# EasyEDA schematic Esquematico.json

## Sheets
1 ESP32-S3: TITLE: Sheet_1; REV: 1.0; Date: 2026-09-23; Sheet: 1/1; Company: Your Company
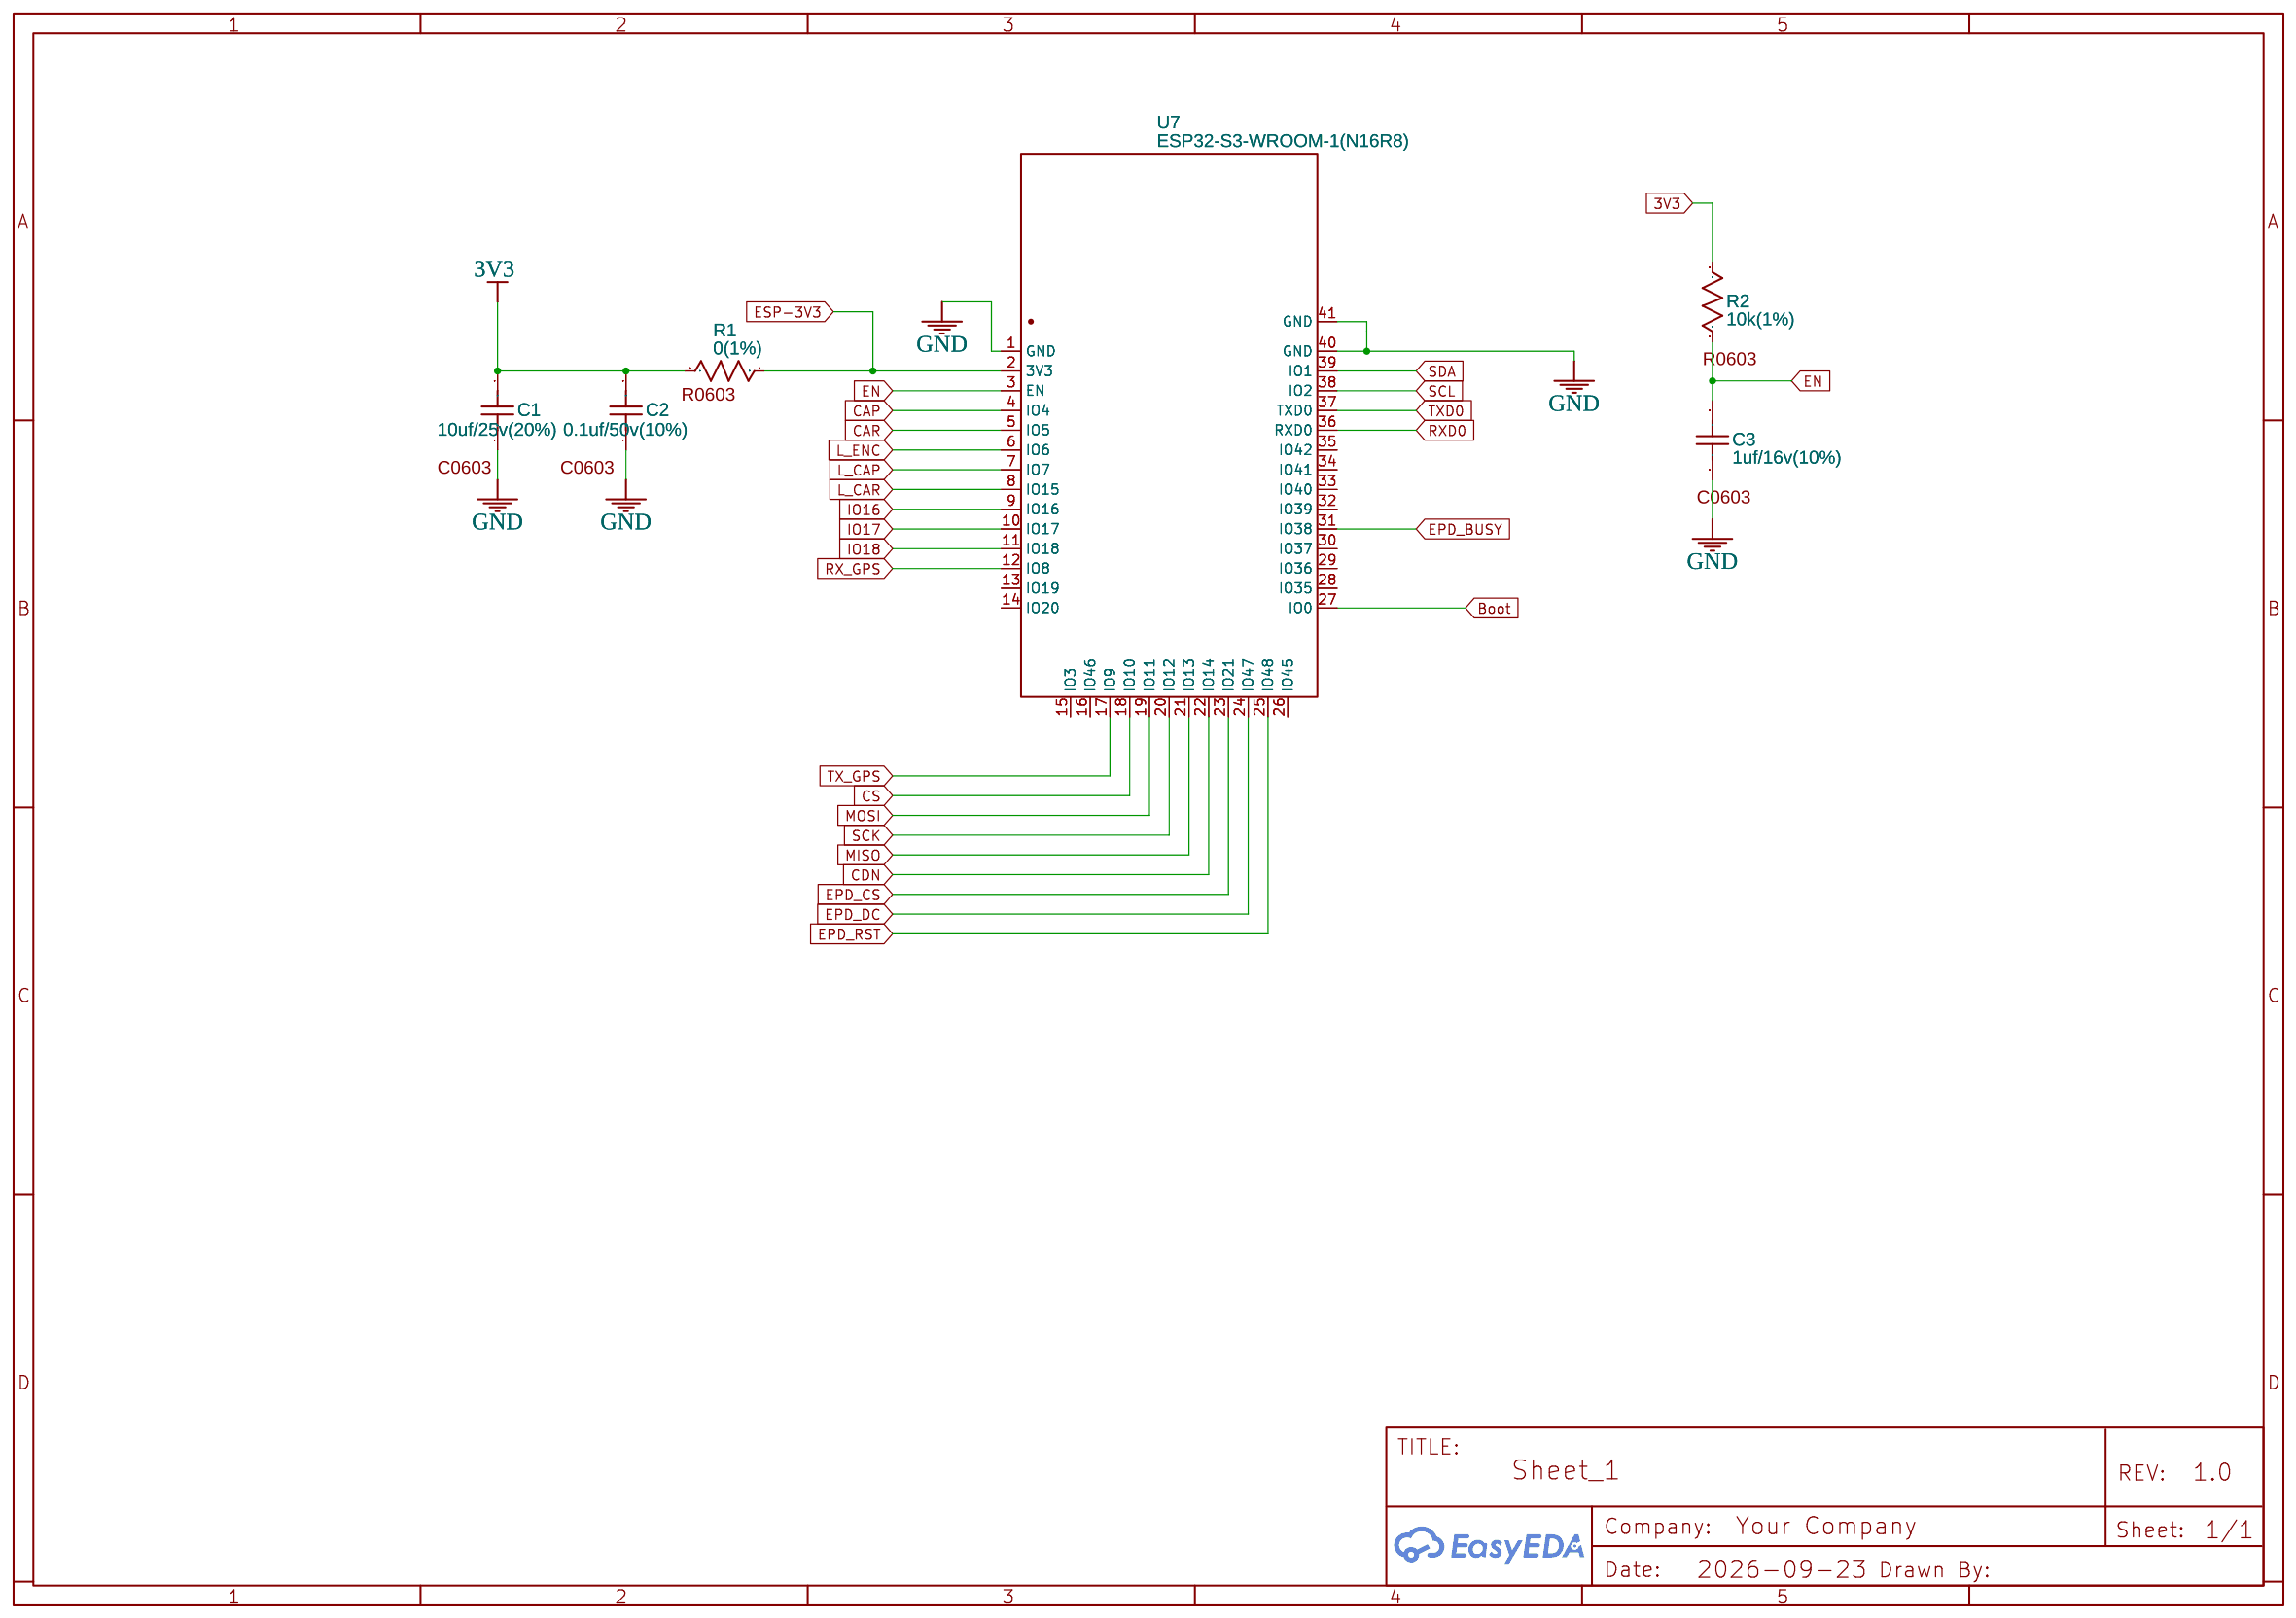
[diagram p0: ESP32-S3]
2 Programacion: TITLE: Sheet_2; Date: 2026-09-24
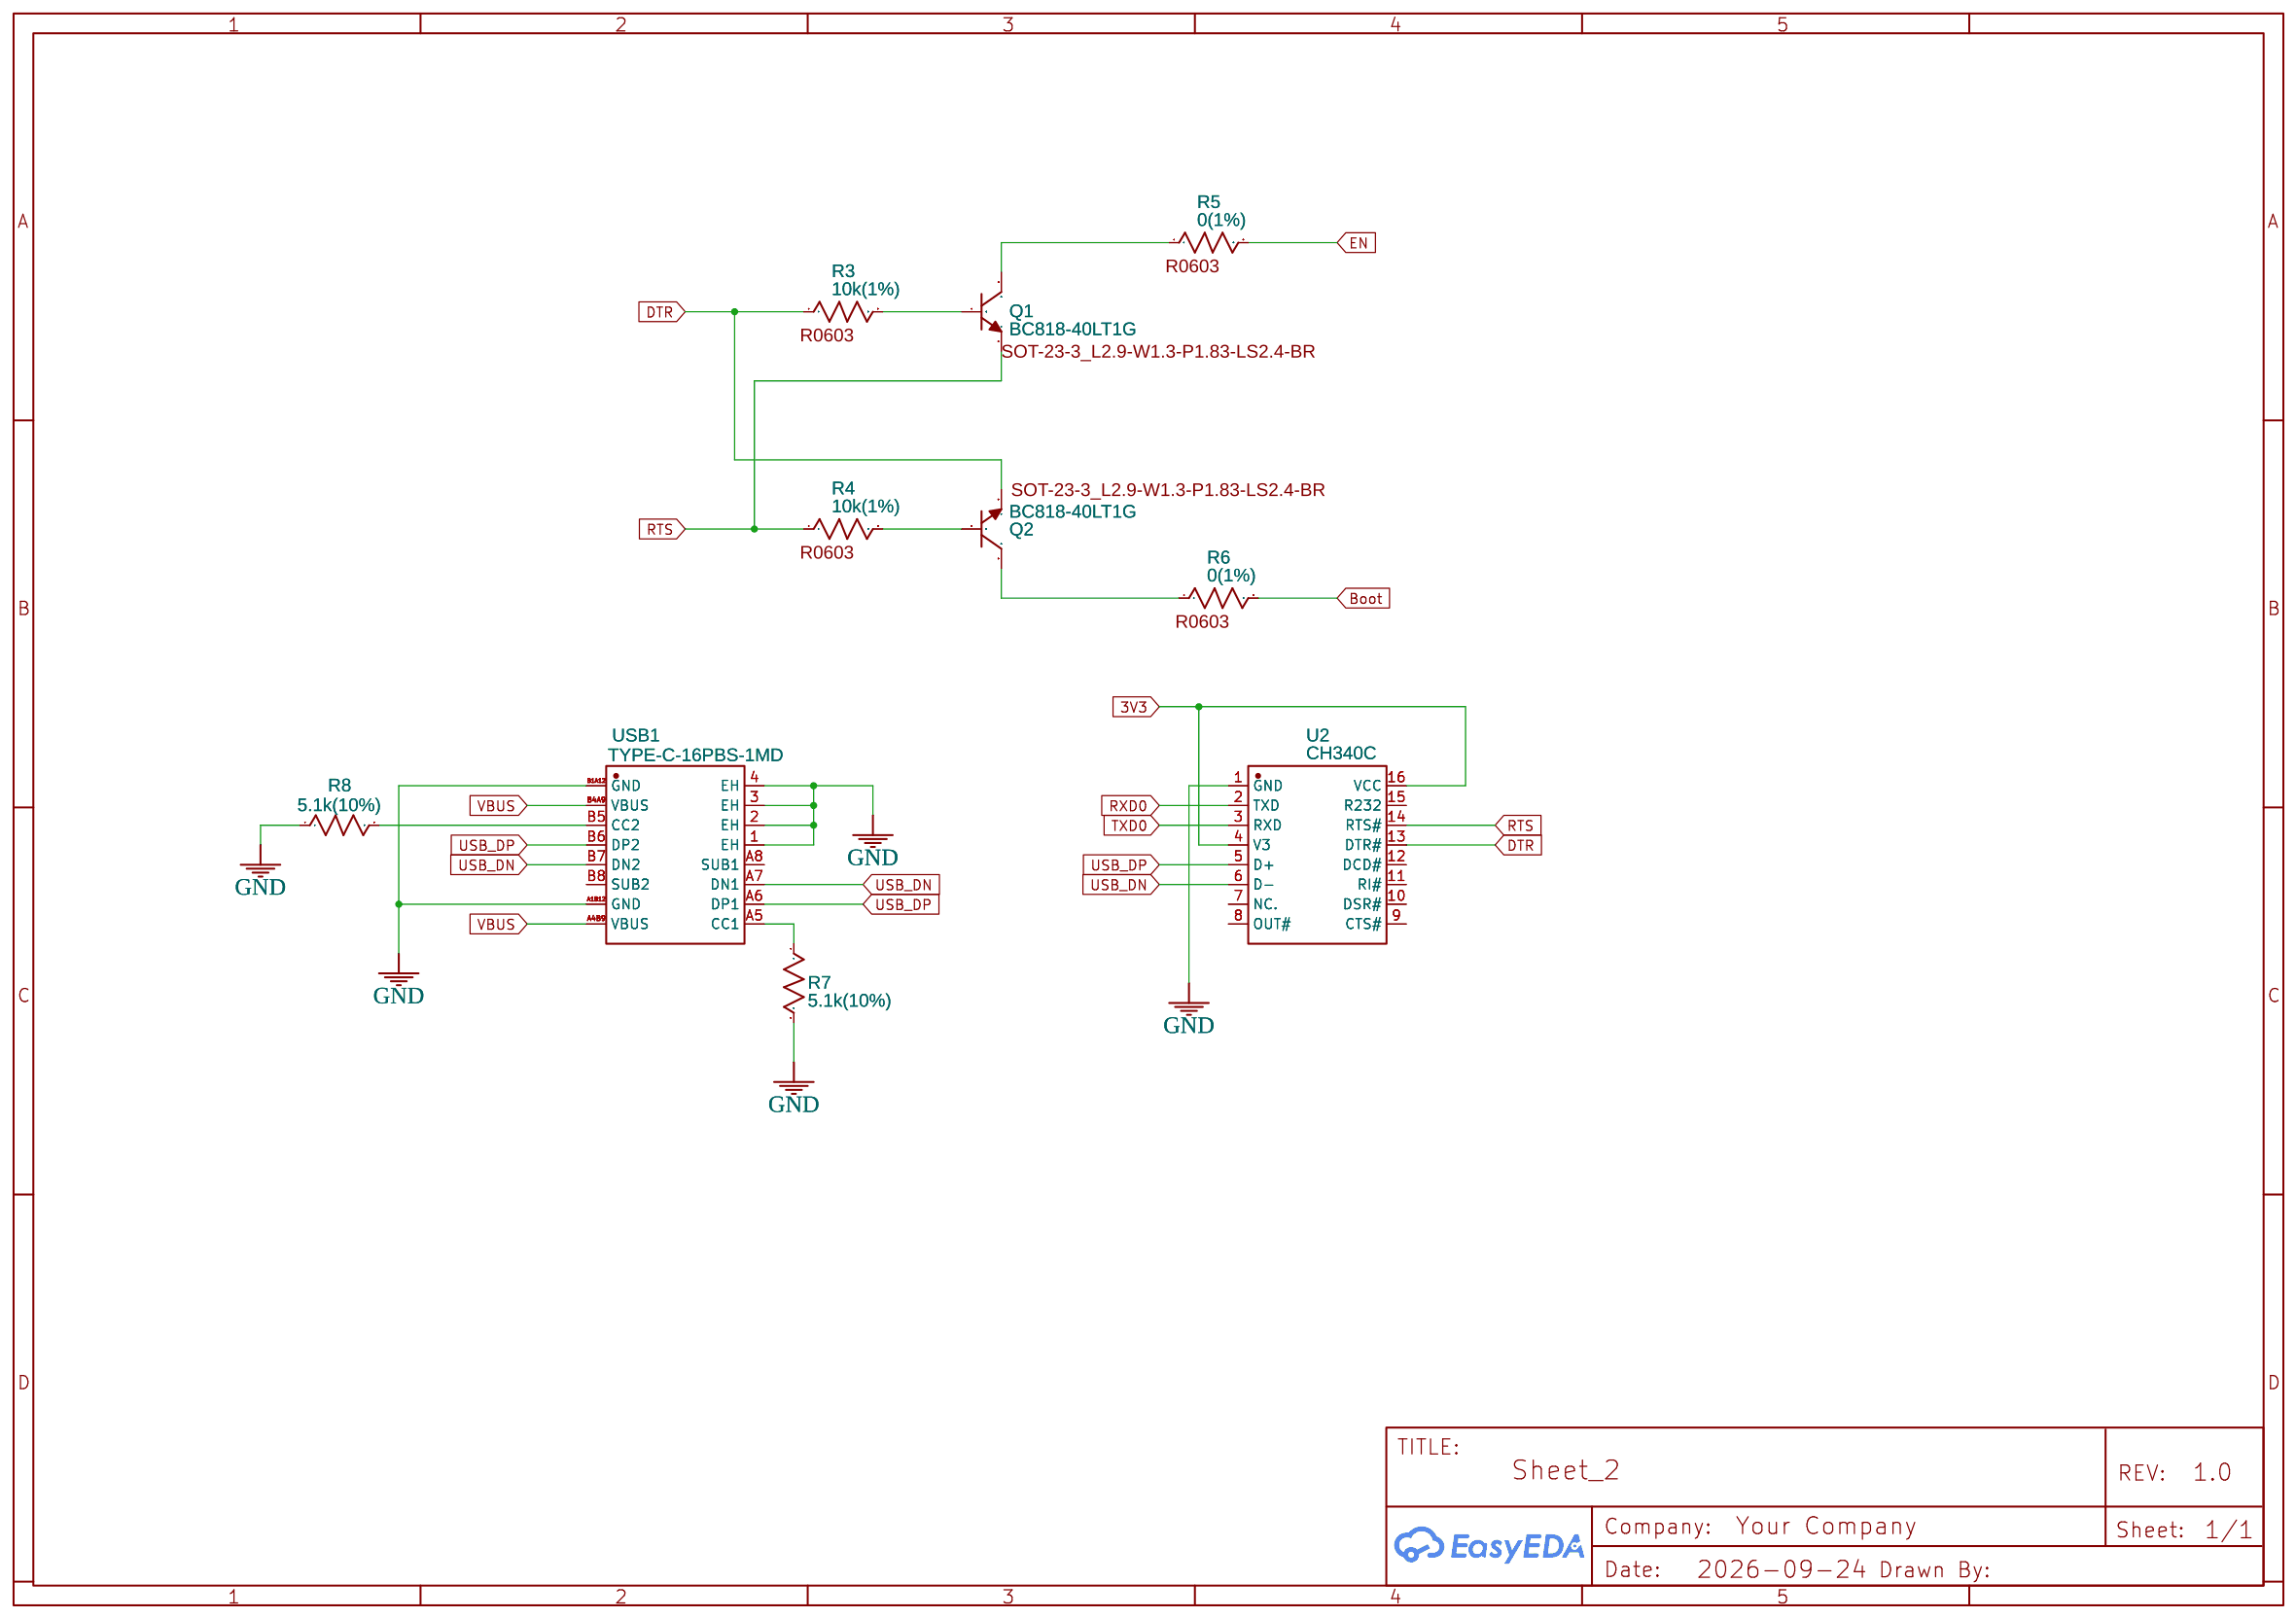
[diagram p1: Programacion]
3 12V a 3V3: TITLE: Sheet_2; Date: 2026-09-24
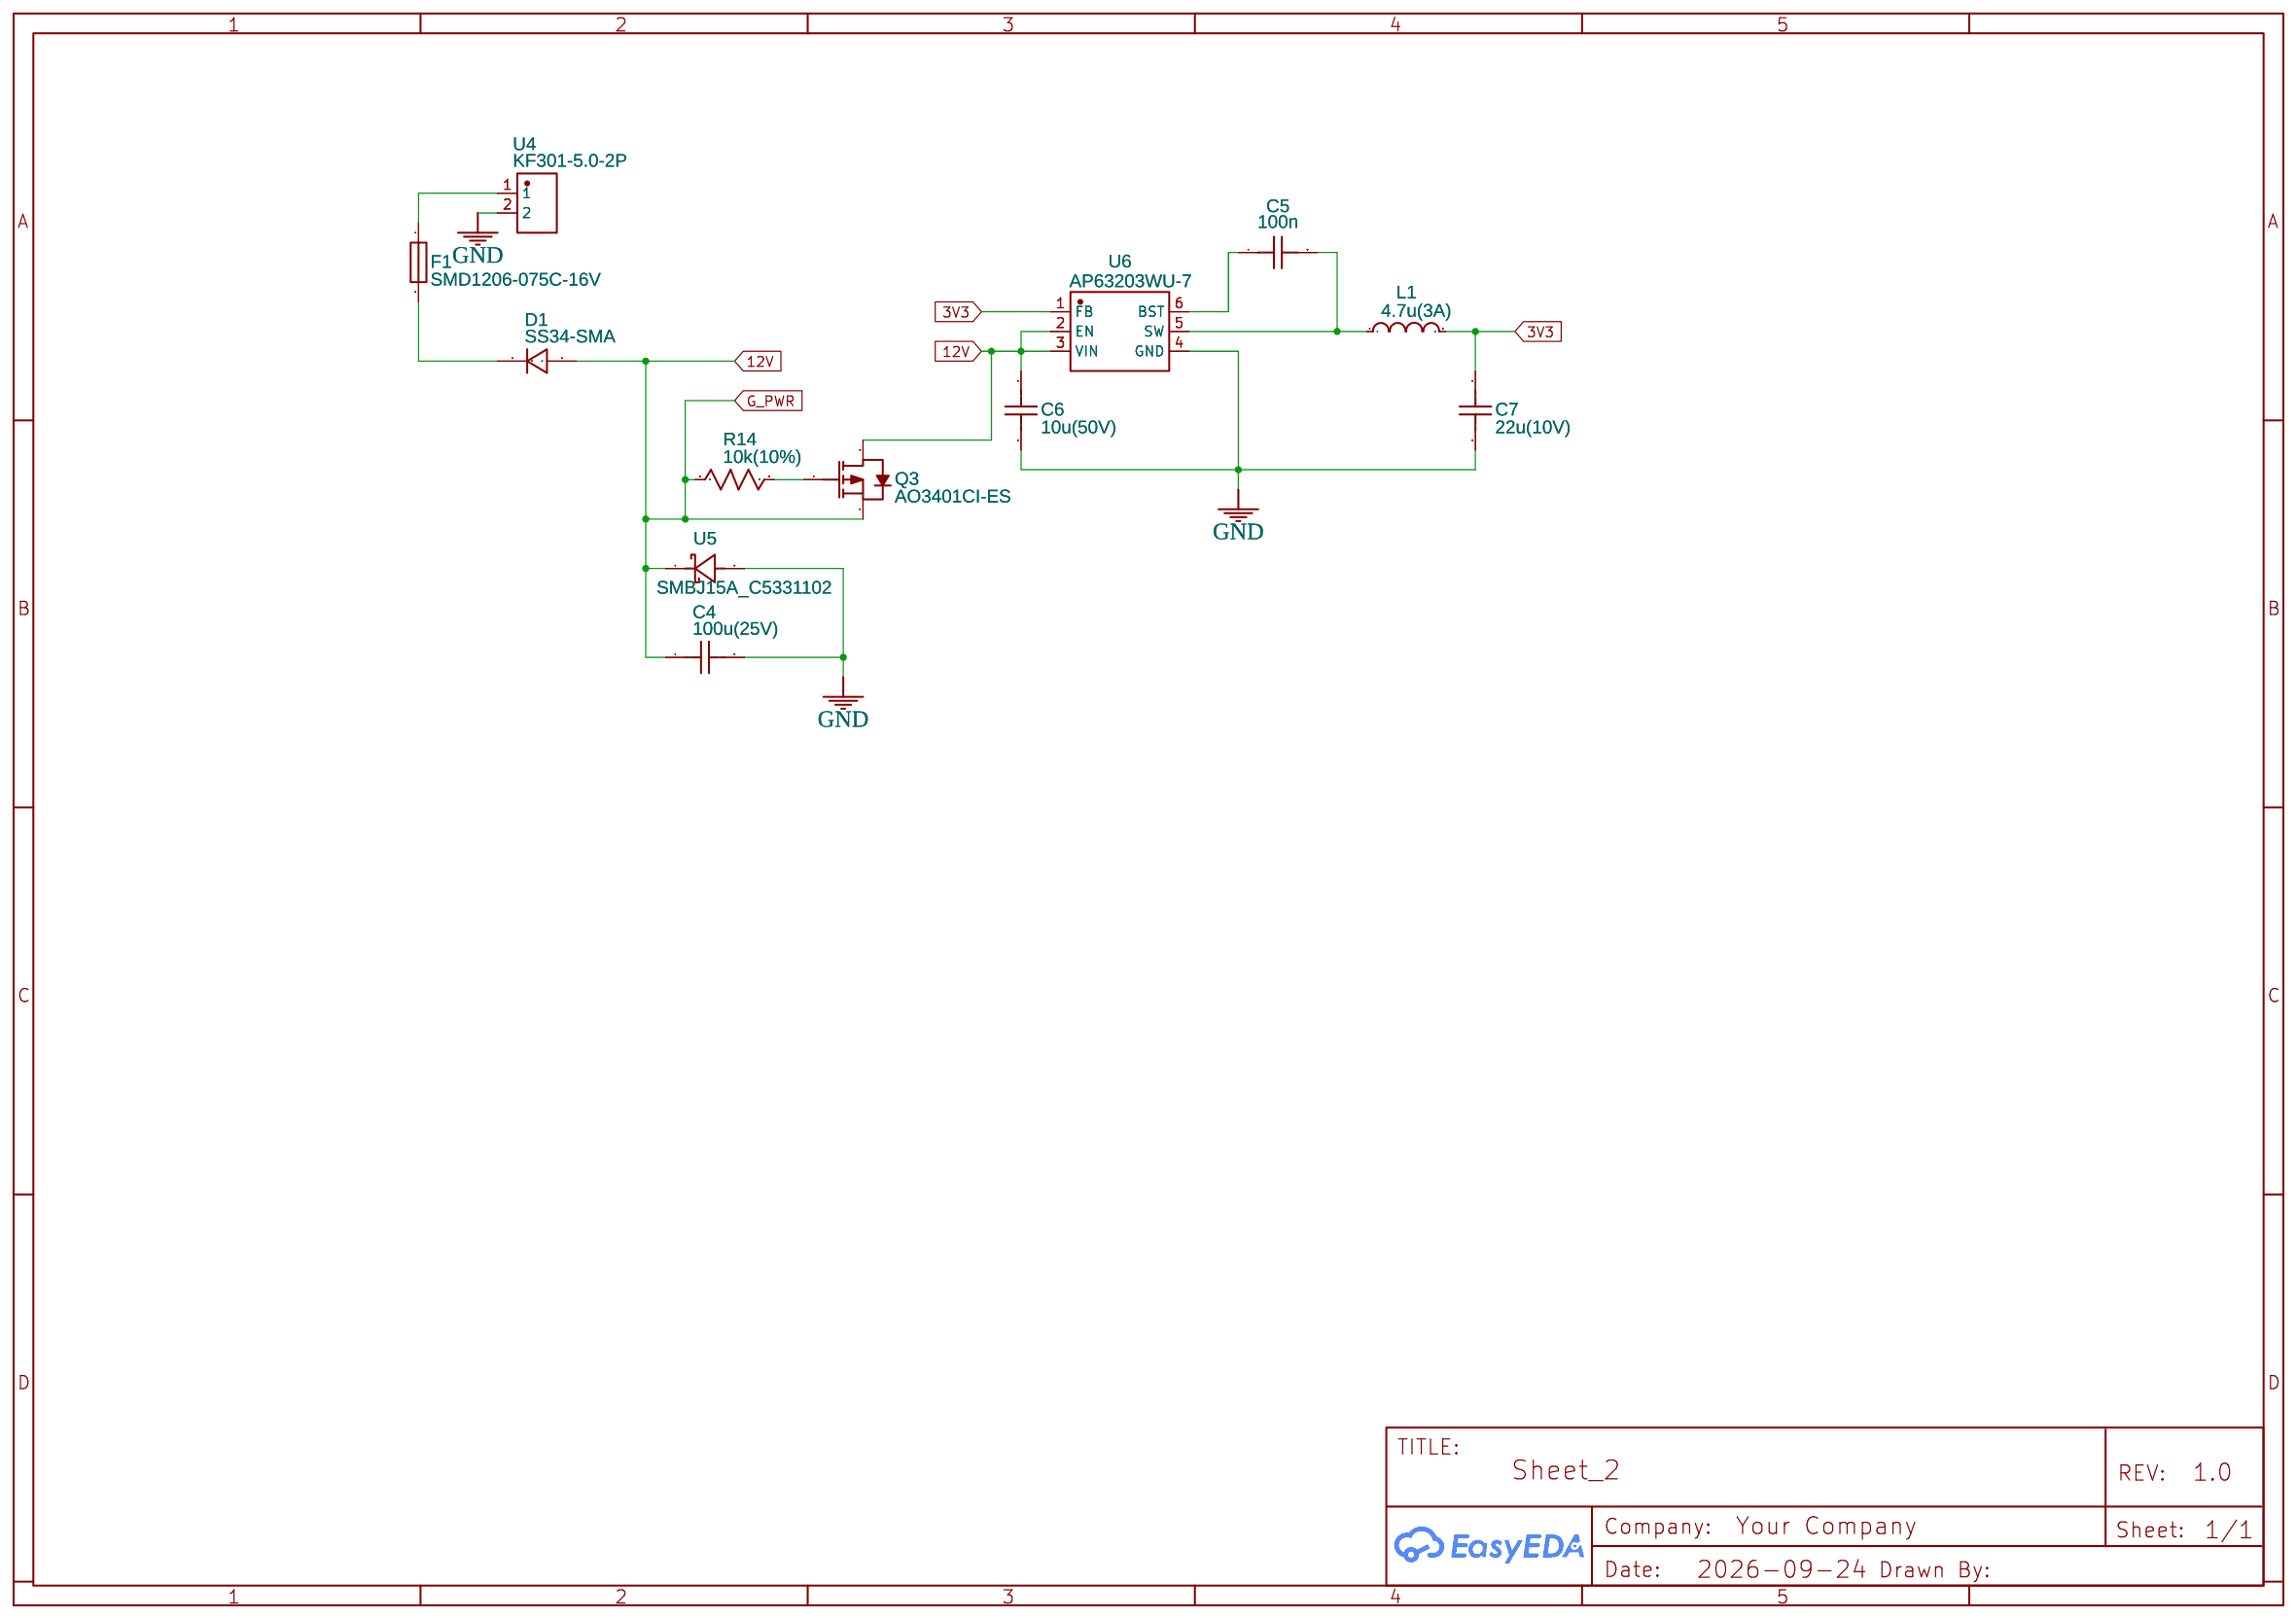
[diagram p2: 12V a 3V3]
4 sensor NPK, PH, HUMEDAD: TITLE: Sheet_2; Date: 2026-09-24
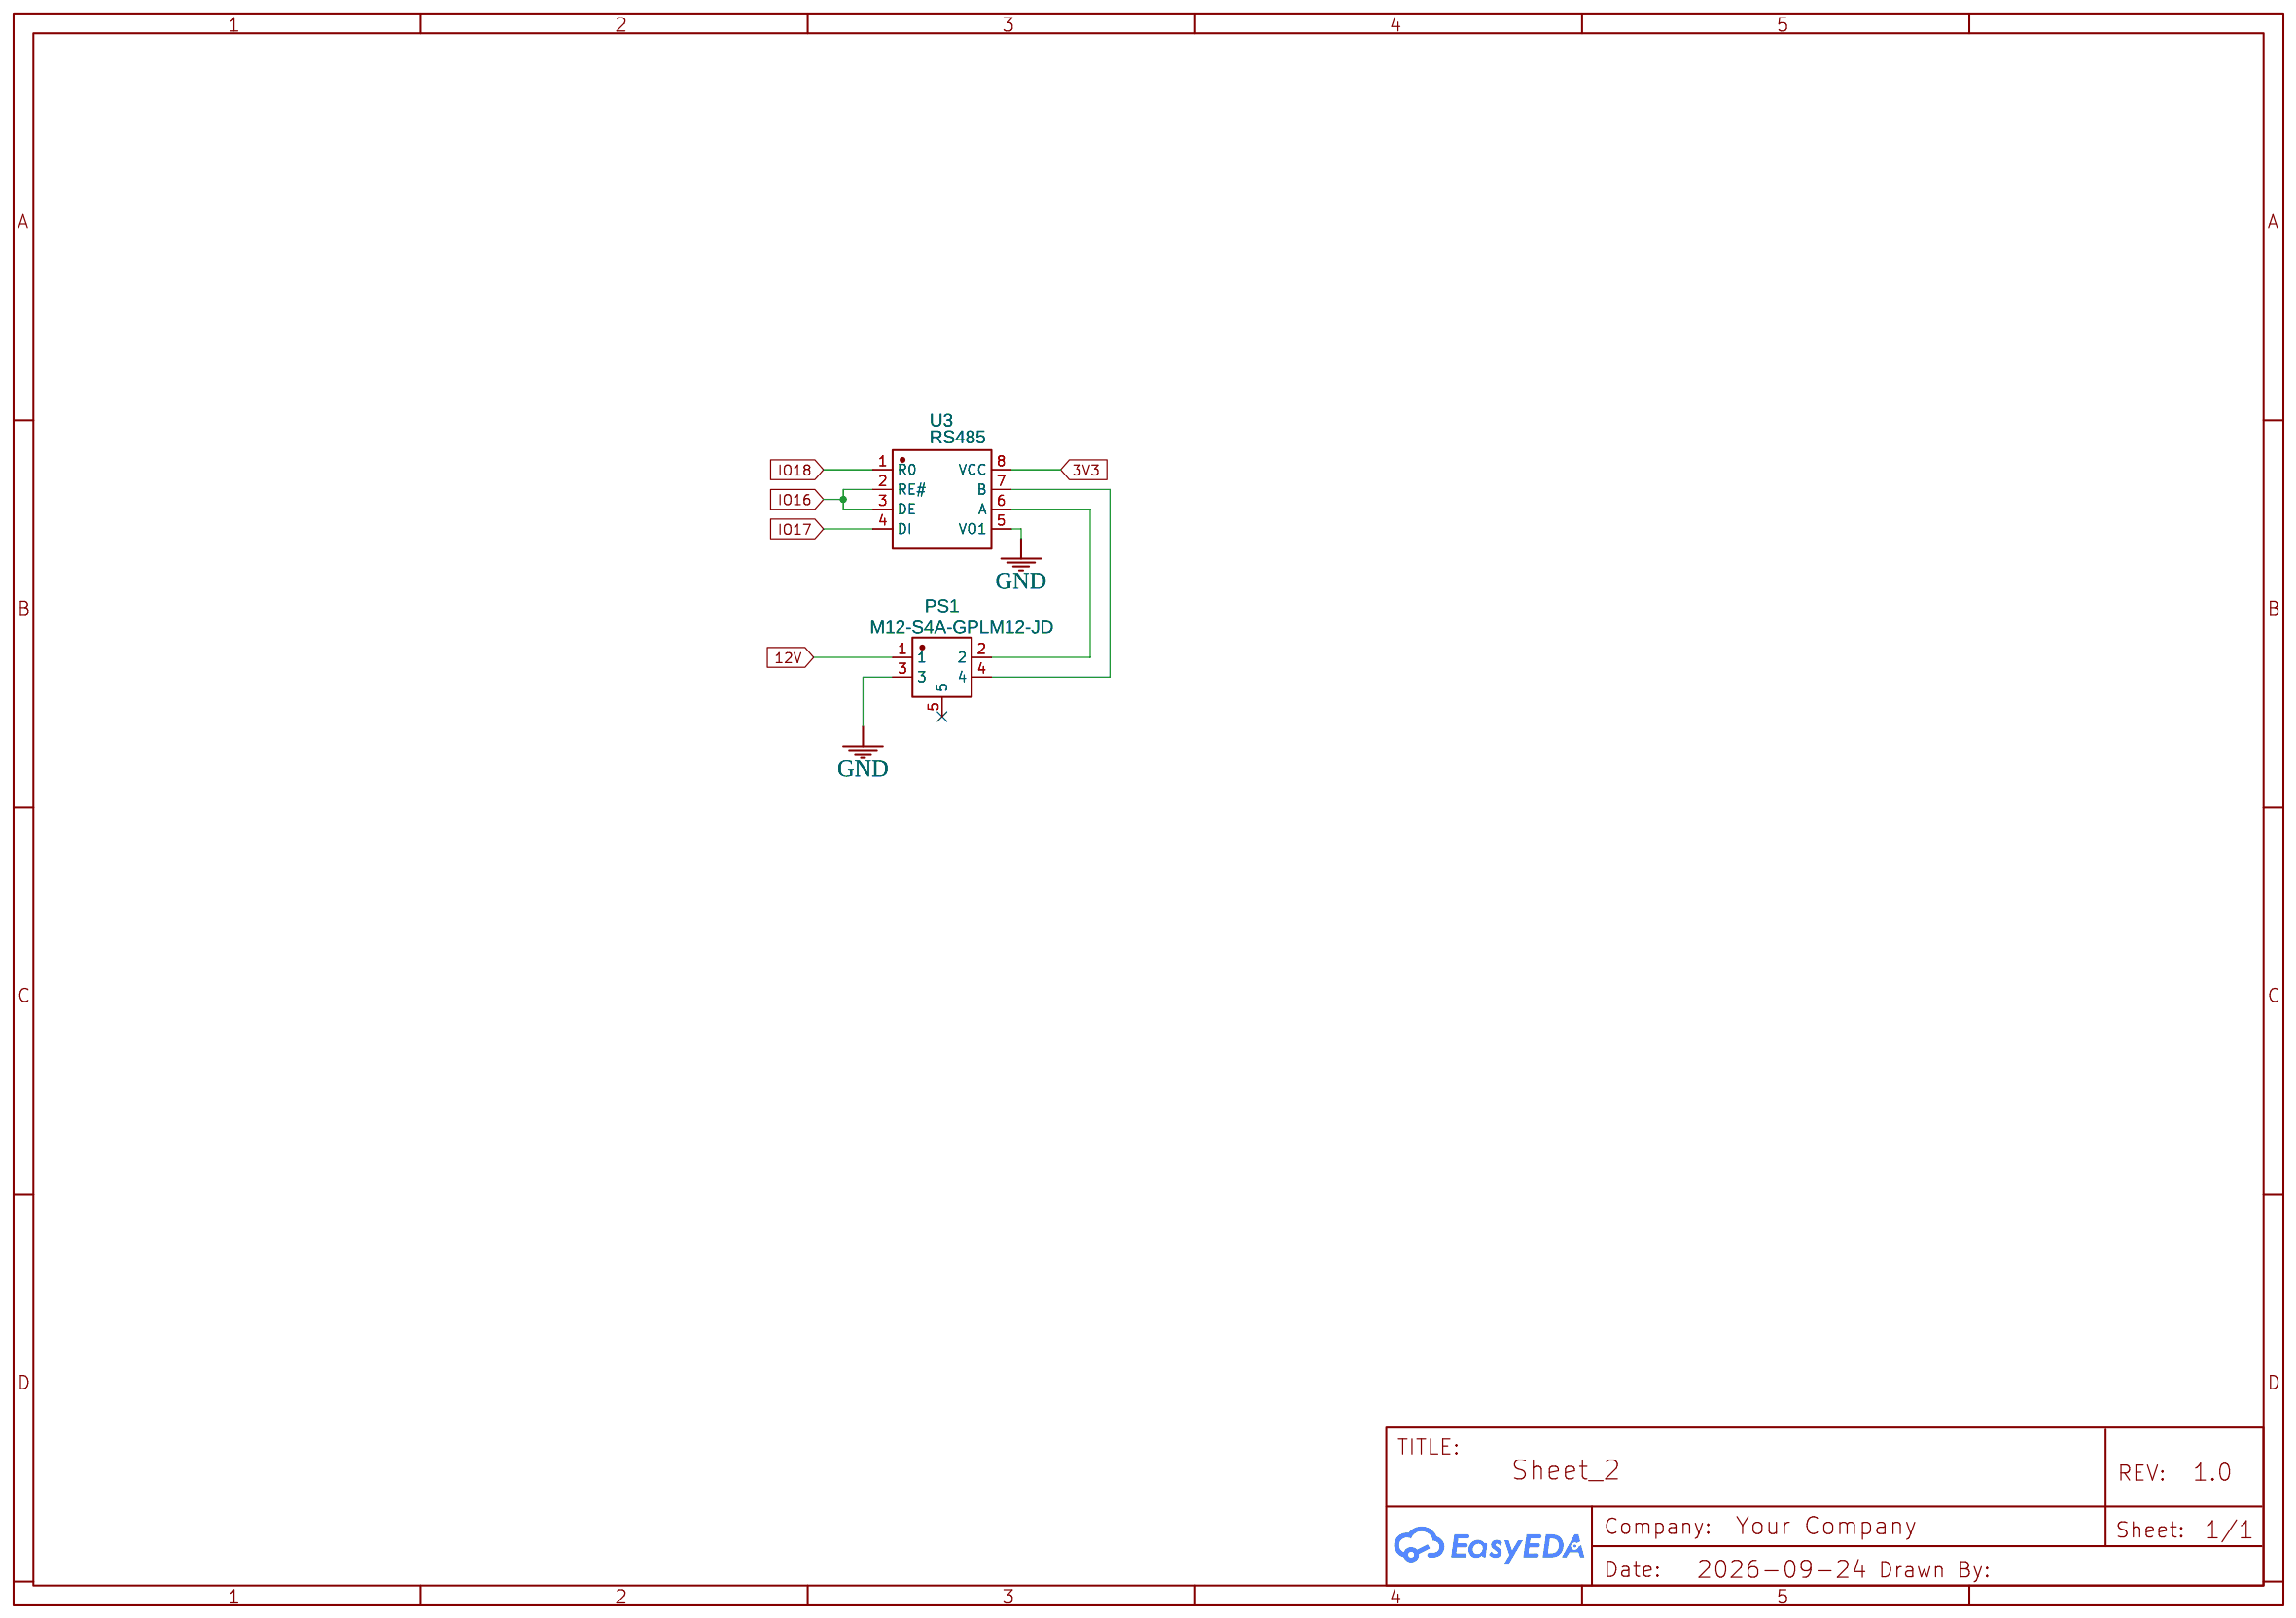
[diagram p3: sensor NPK, PH, HUMEDAD]
5 EPAPER: Date: 2026-09-24
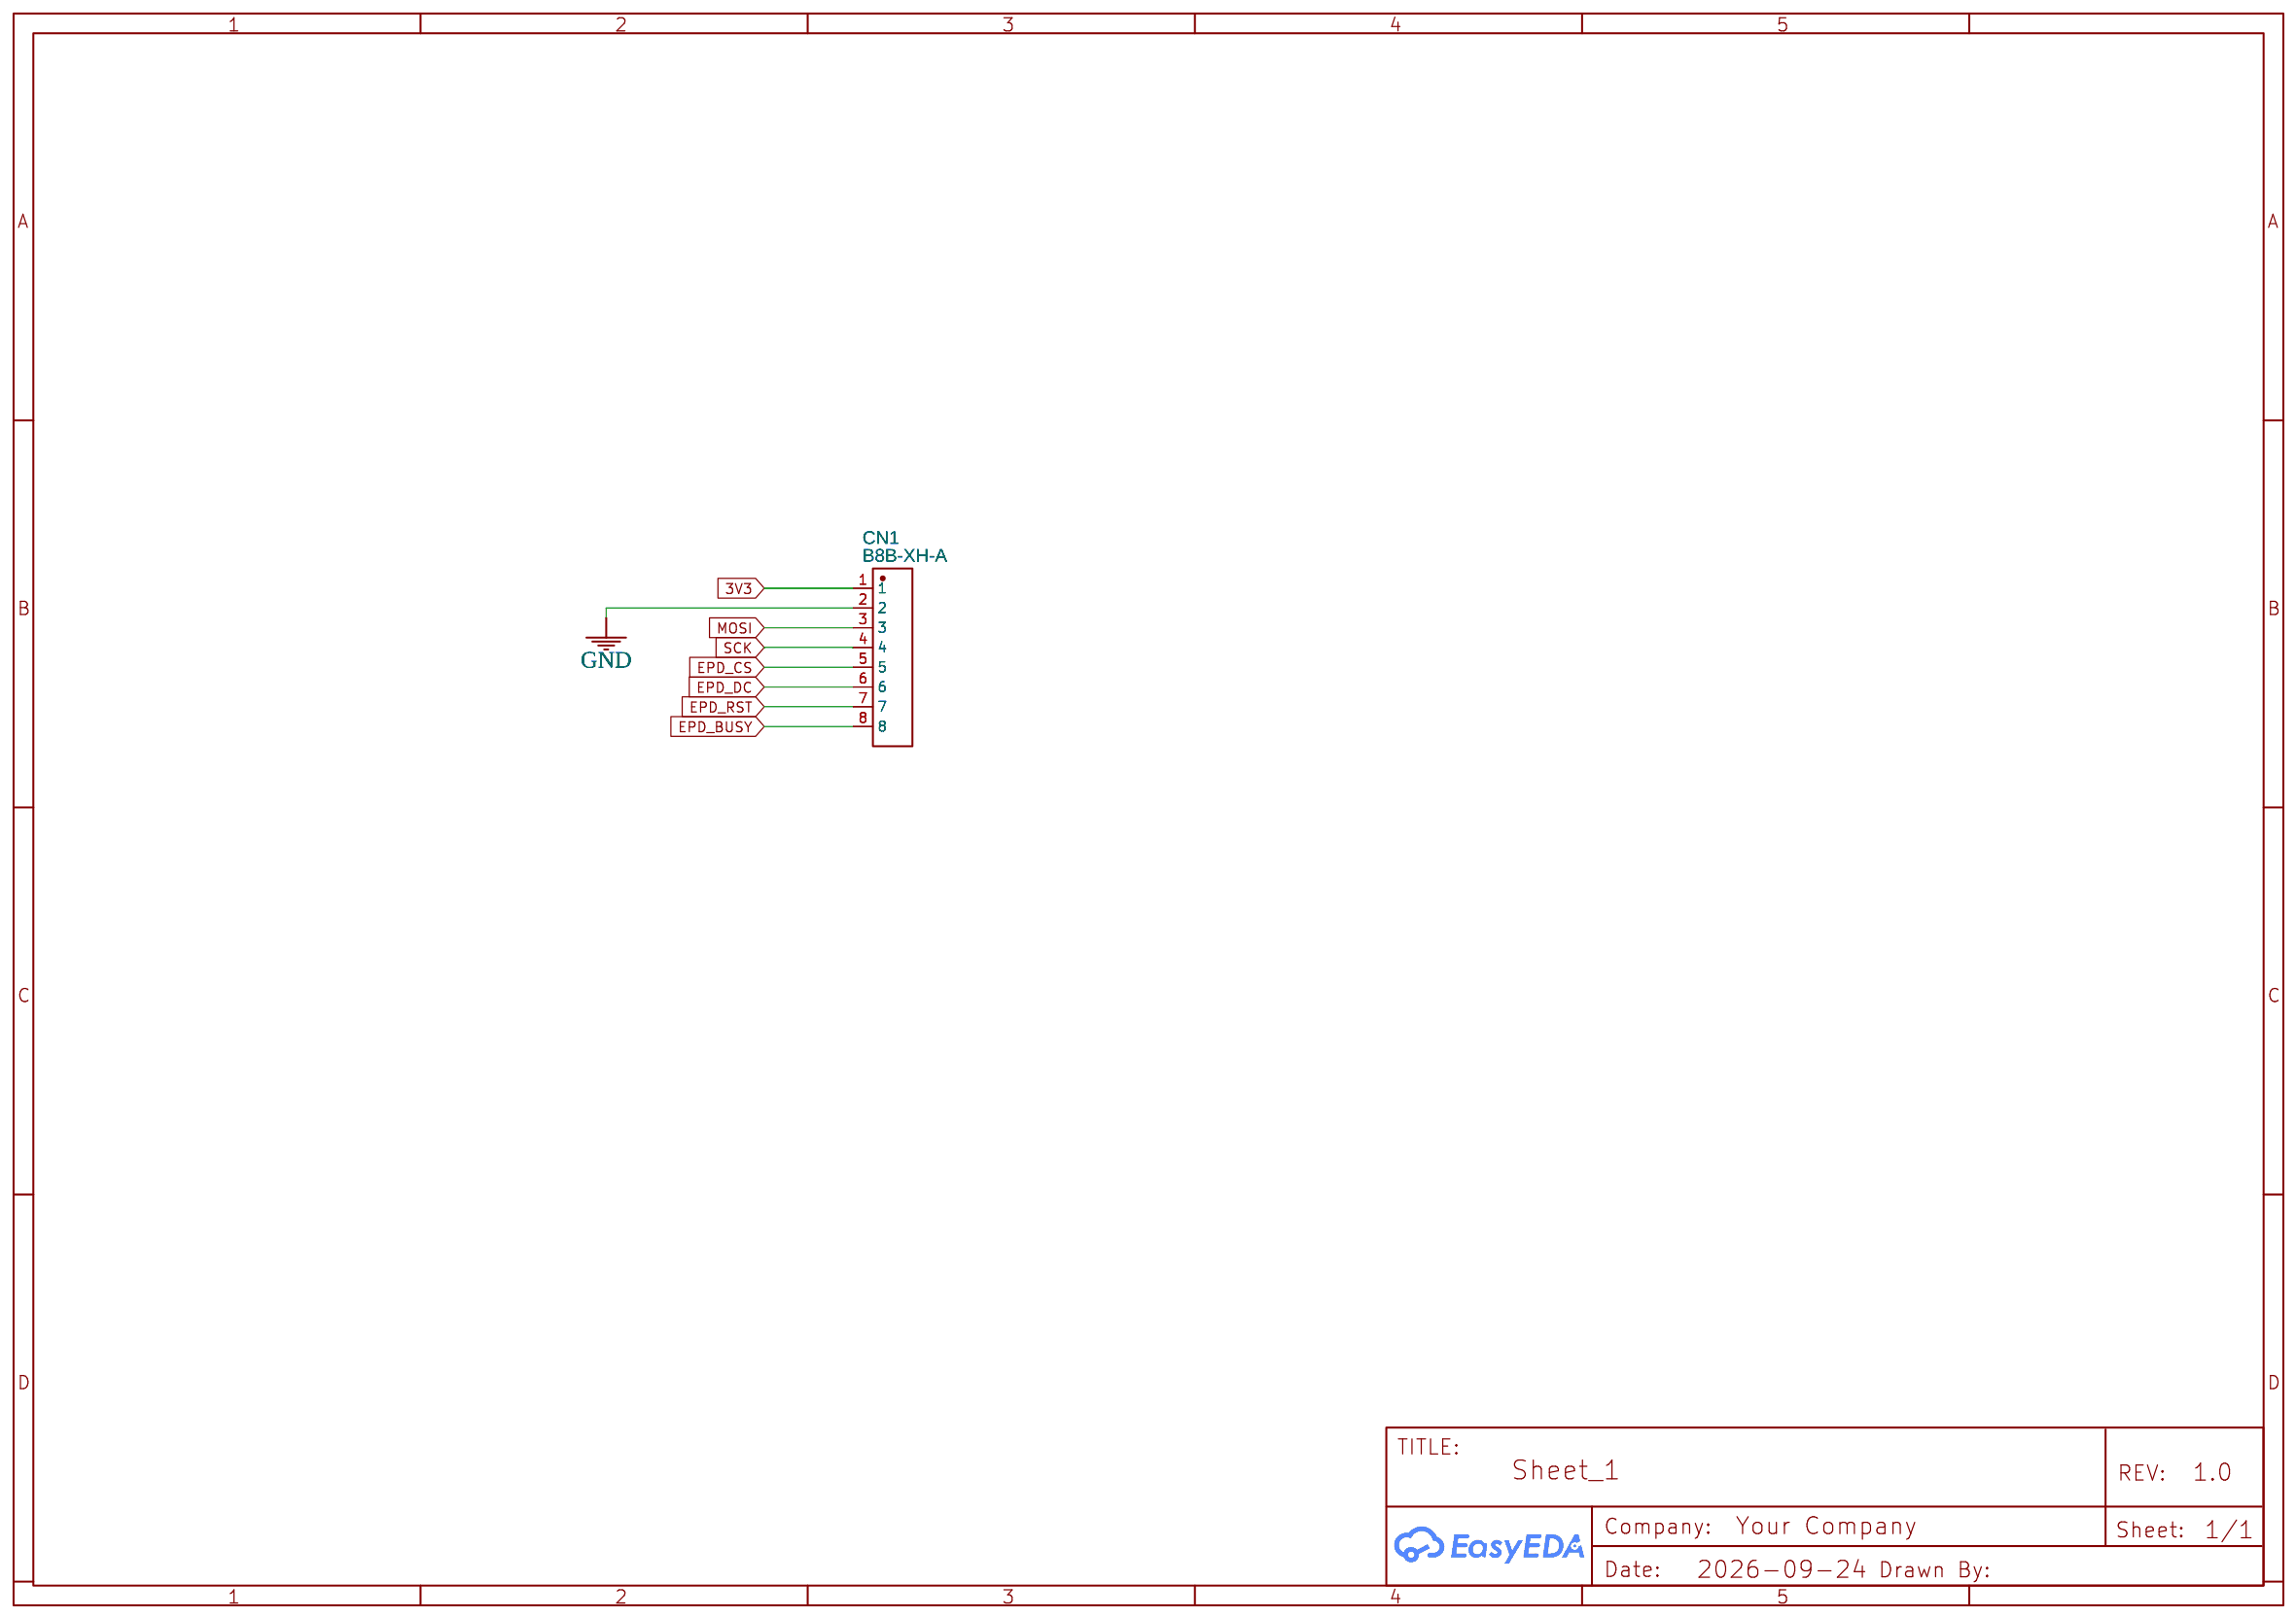
[diagram p4: EPAPER]
6 Reloj: Date: 2026-09-24
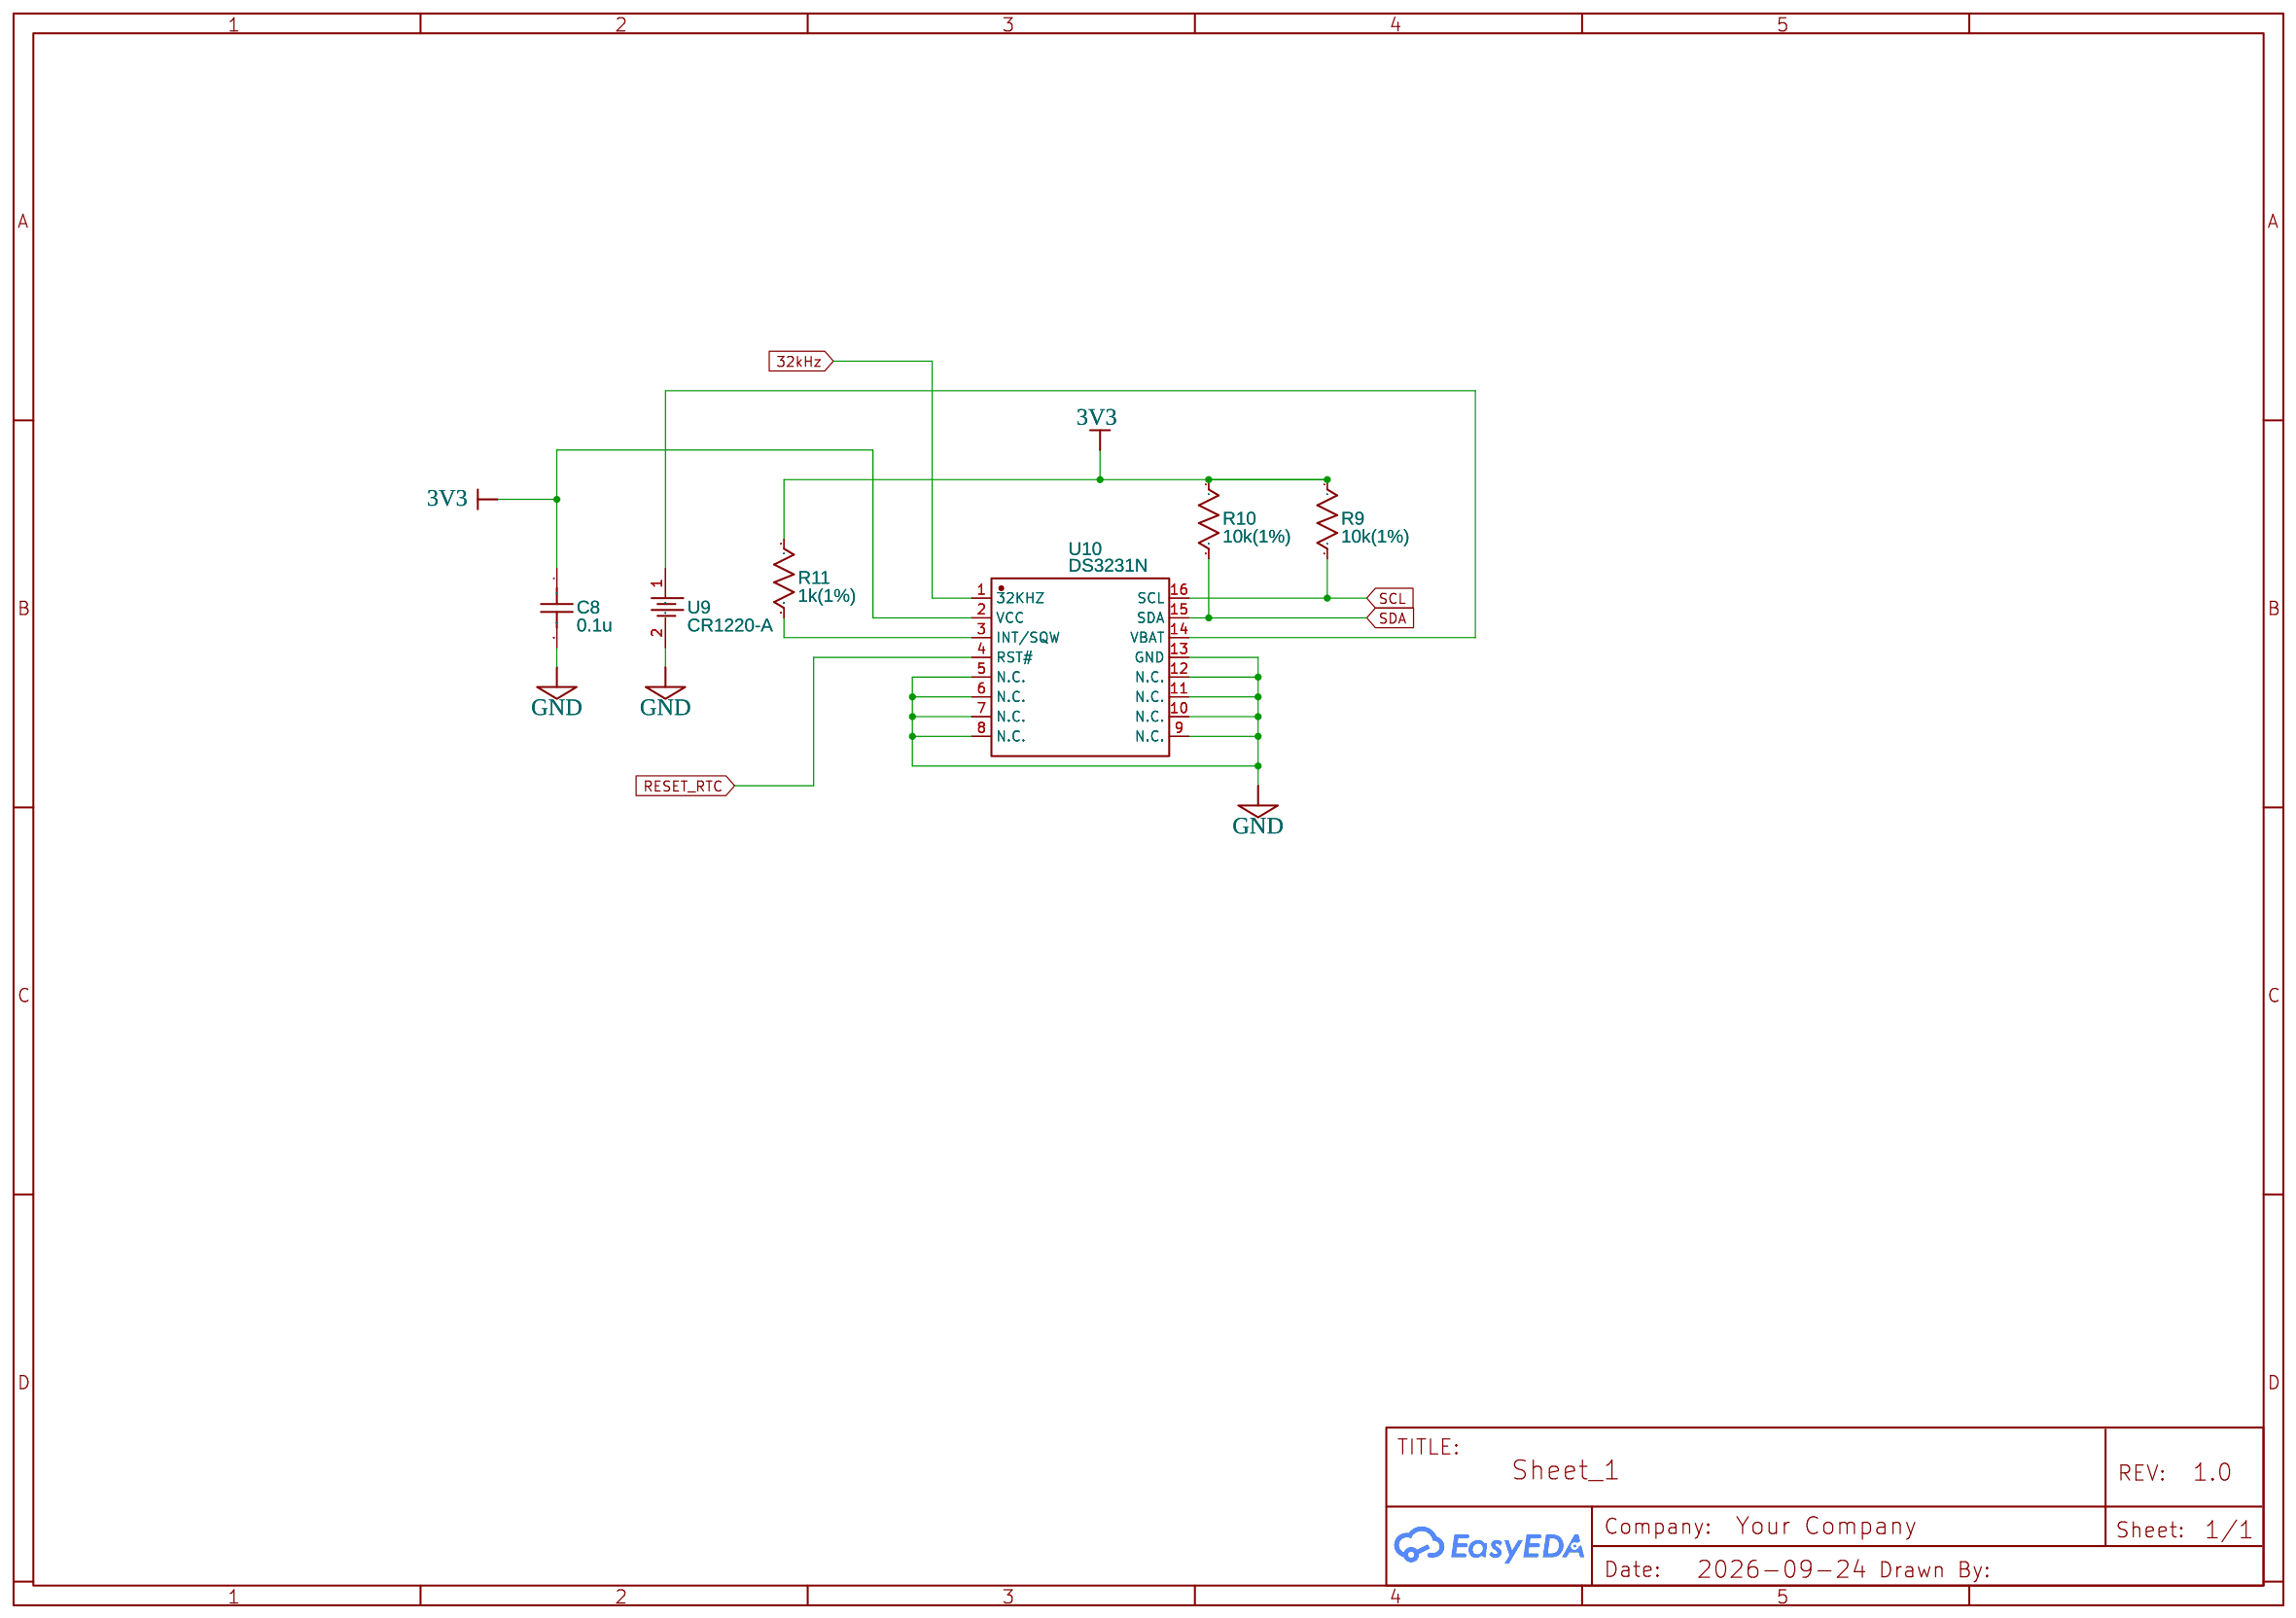
[diagram p5: Reloj]
7 Botones: Date: 2026-09-24
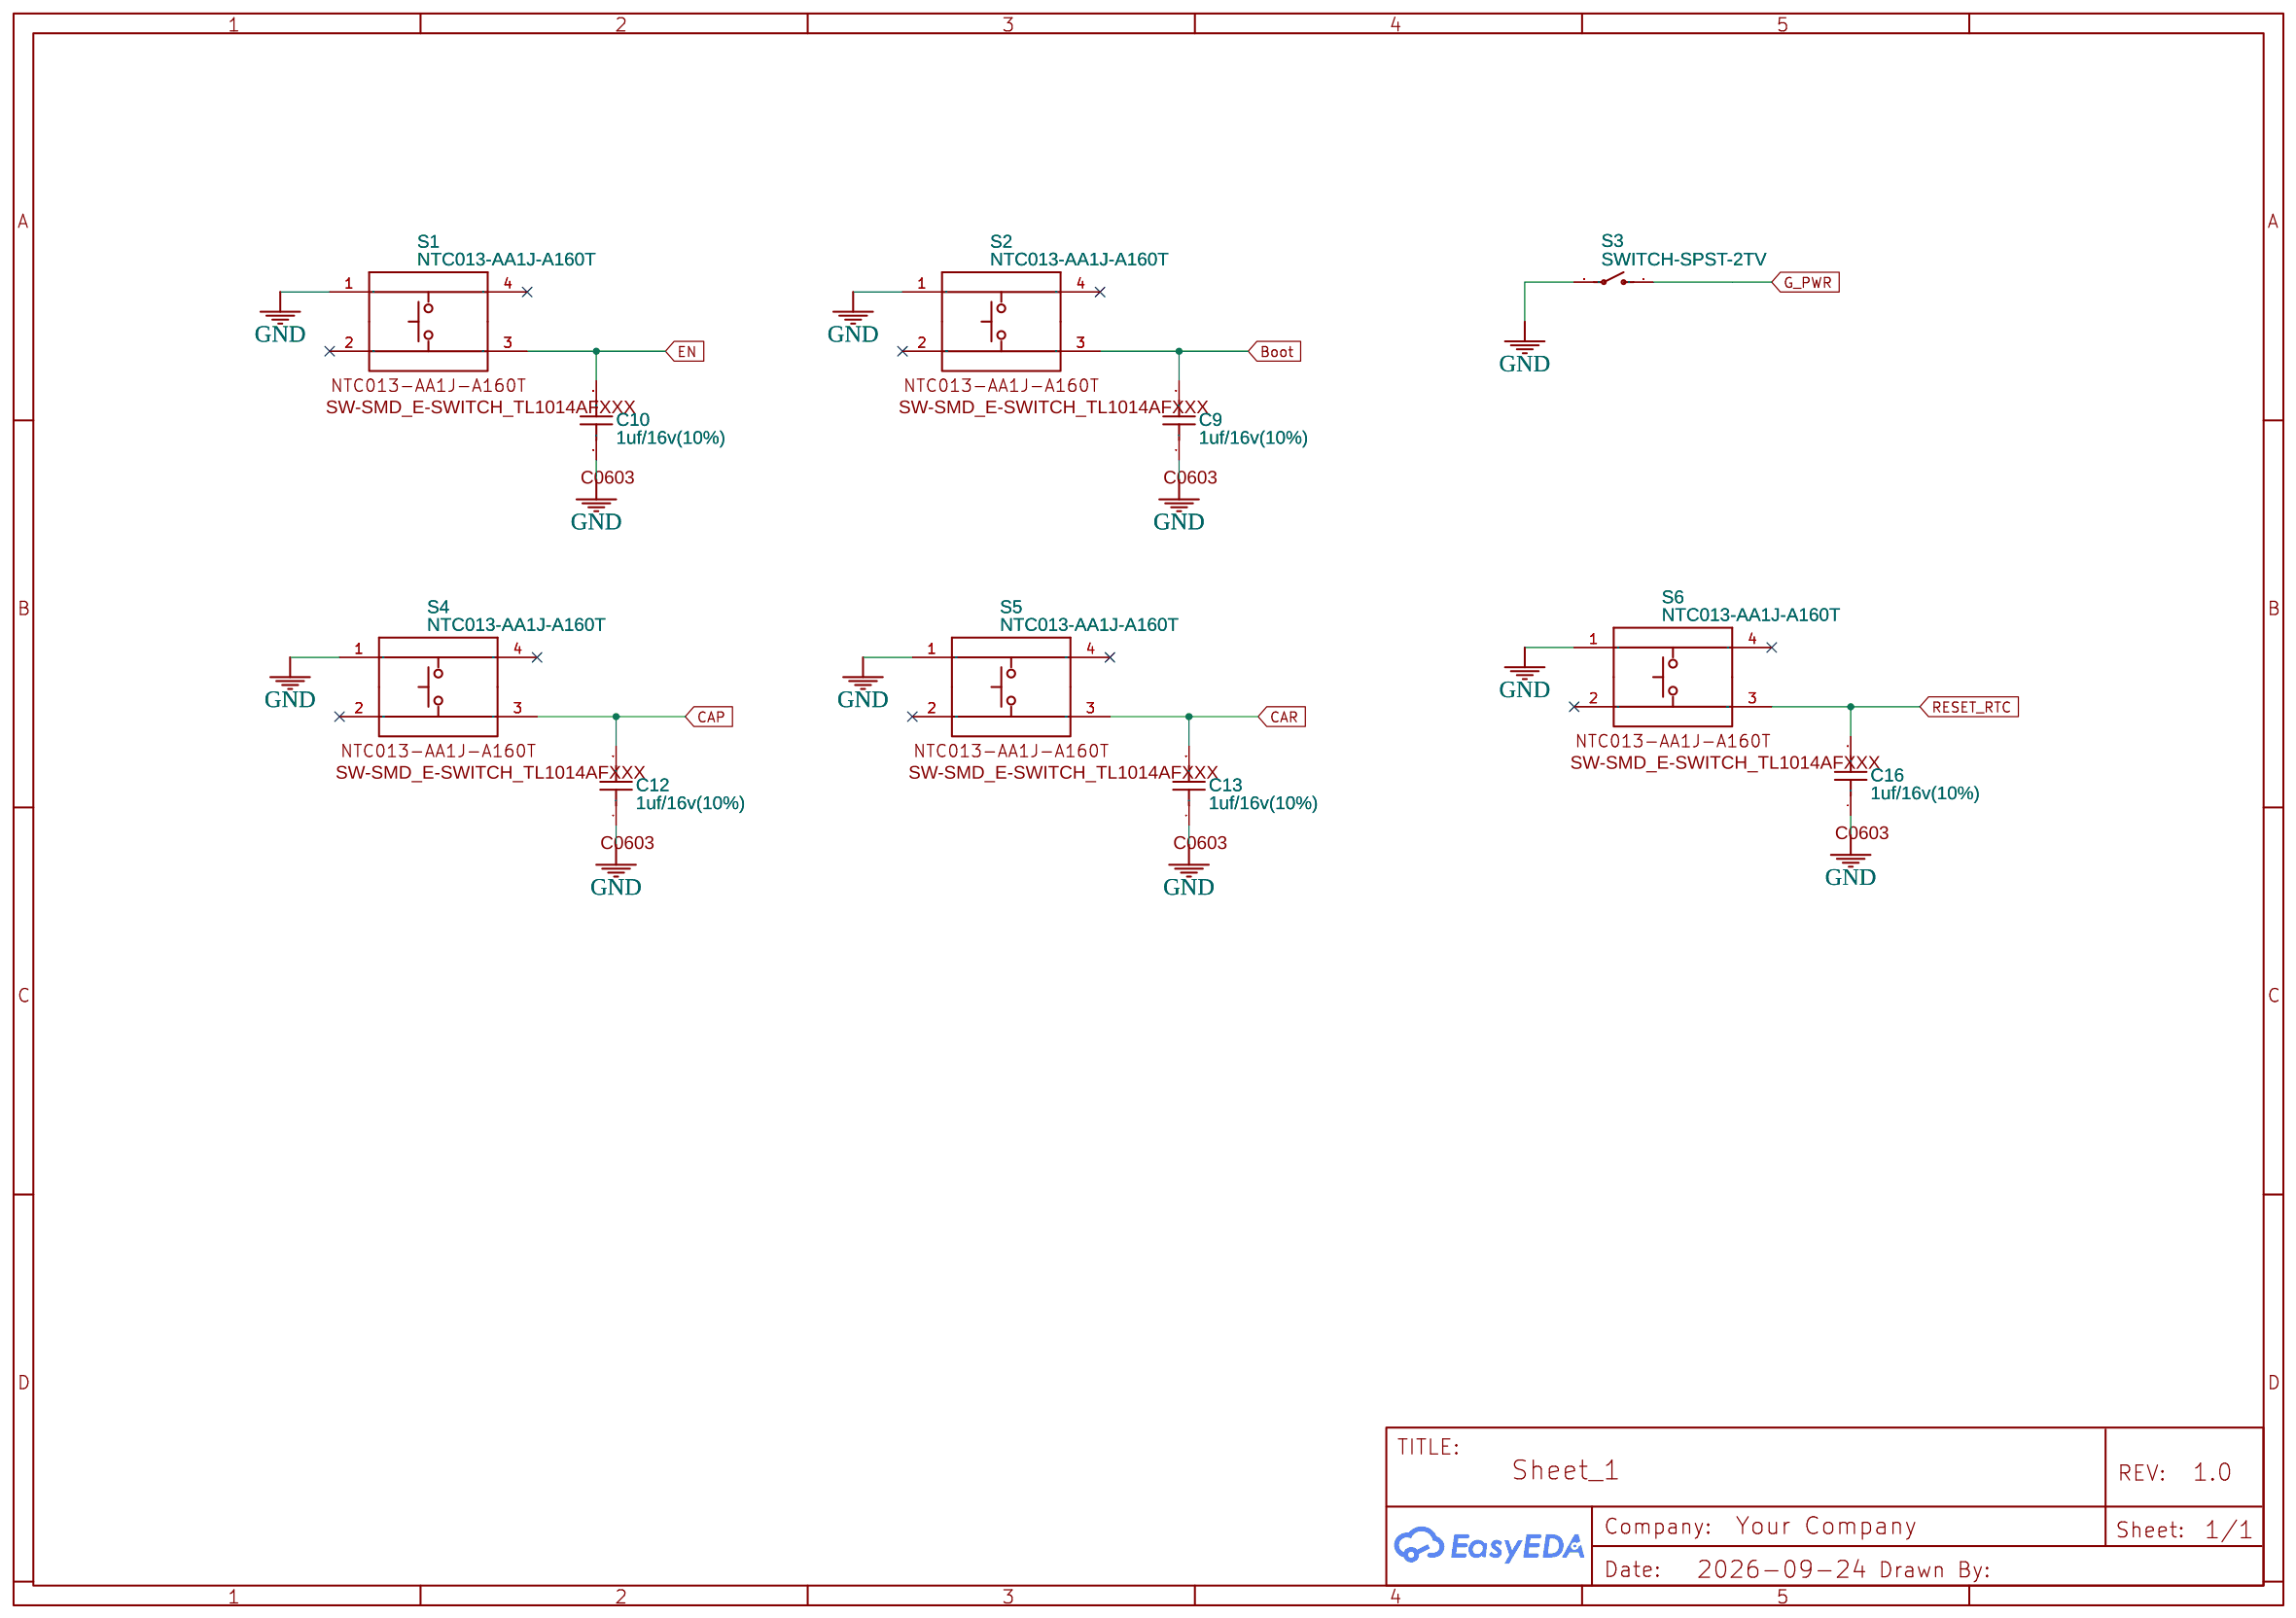
[diagram p6: Botones]
8 GPS: Date: 2026-09-24
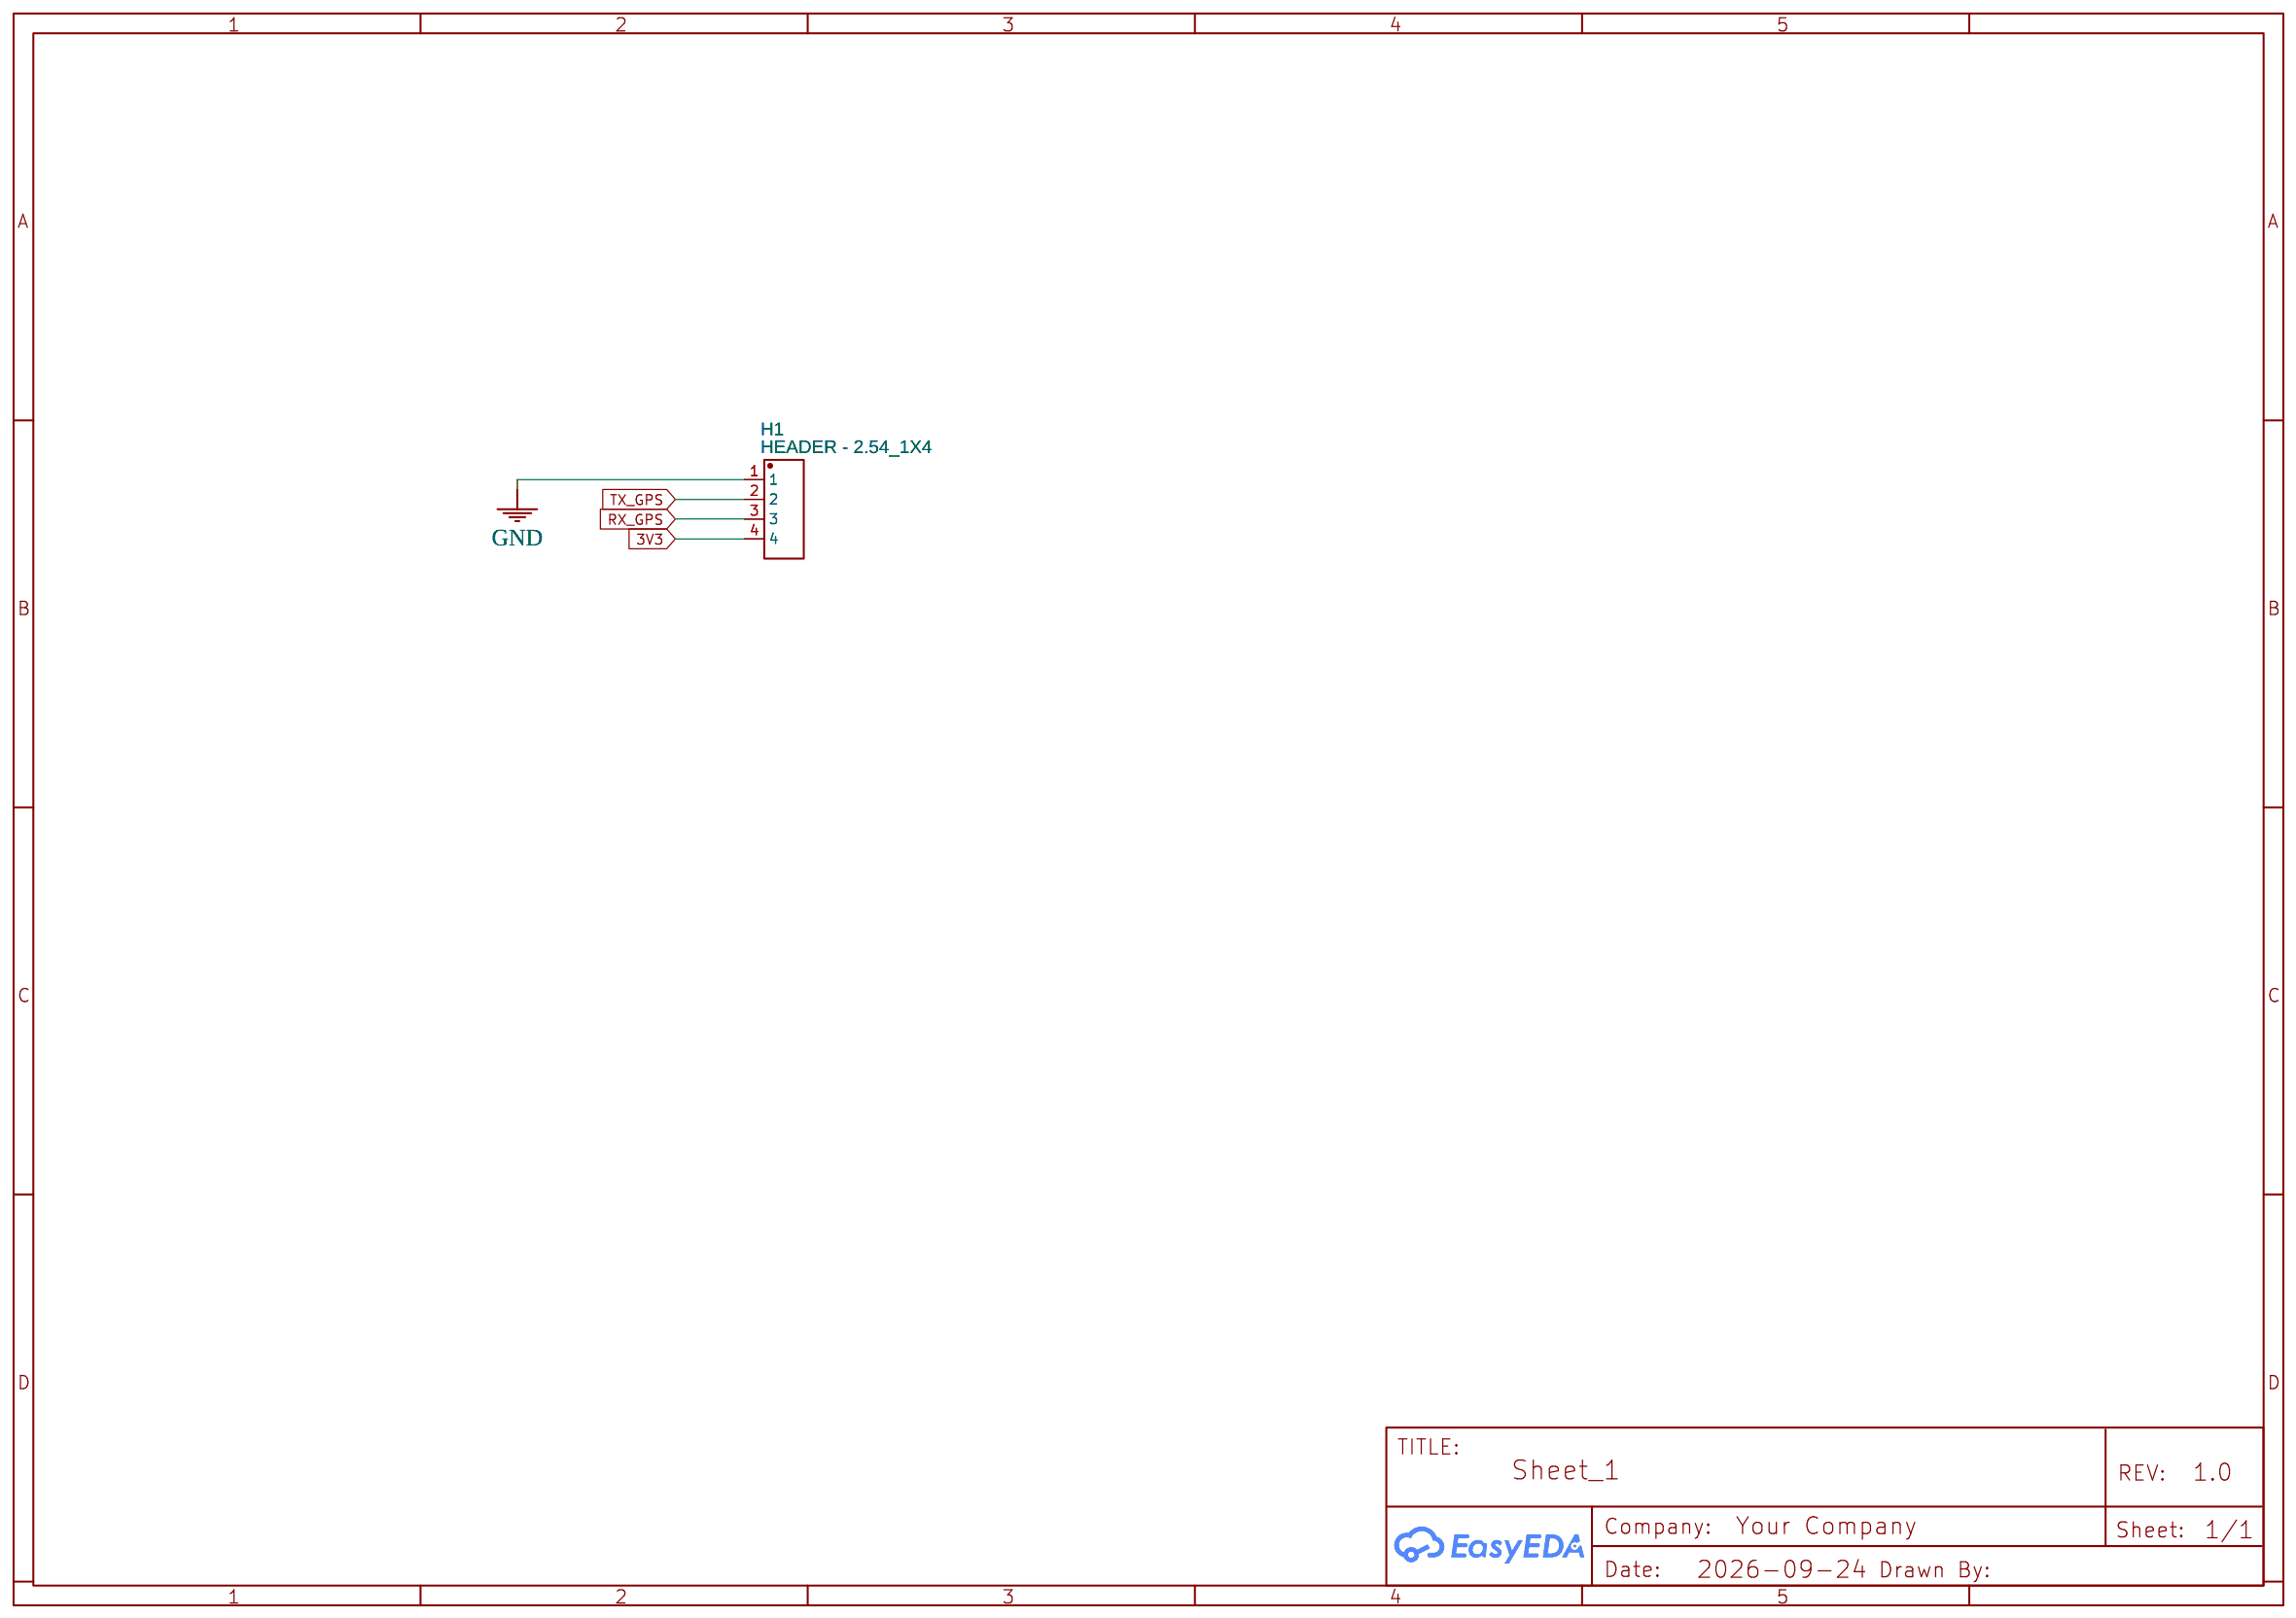
[diagram p7: GPS]
9 ESP32-S3-CAM copy
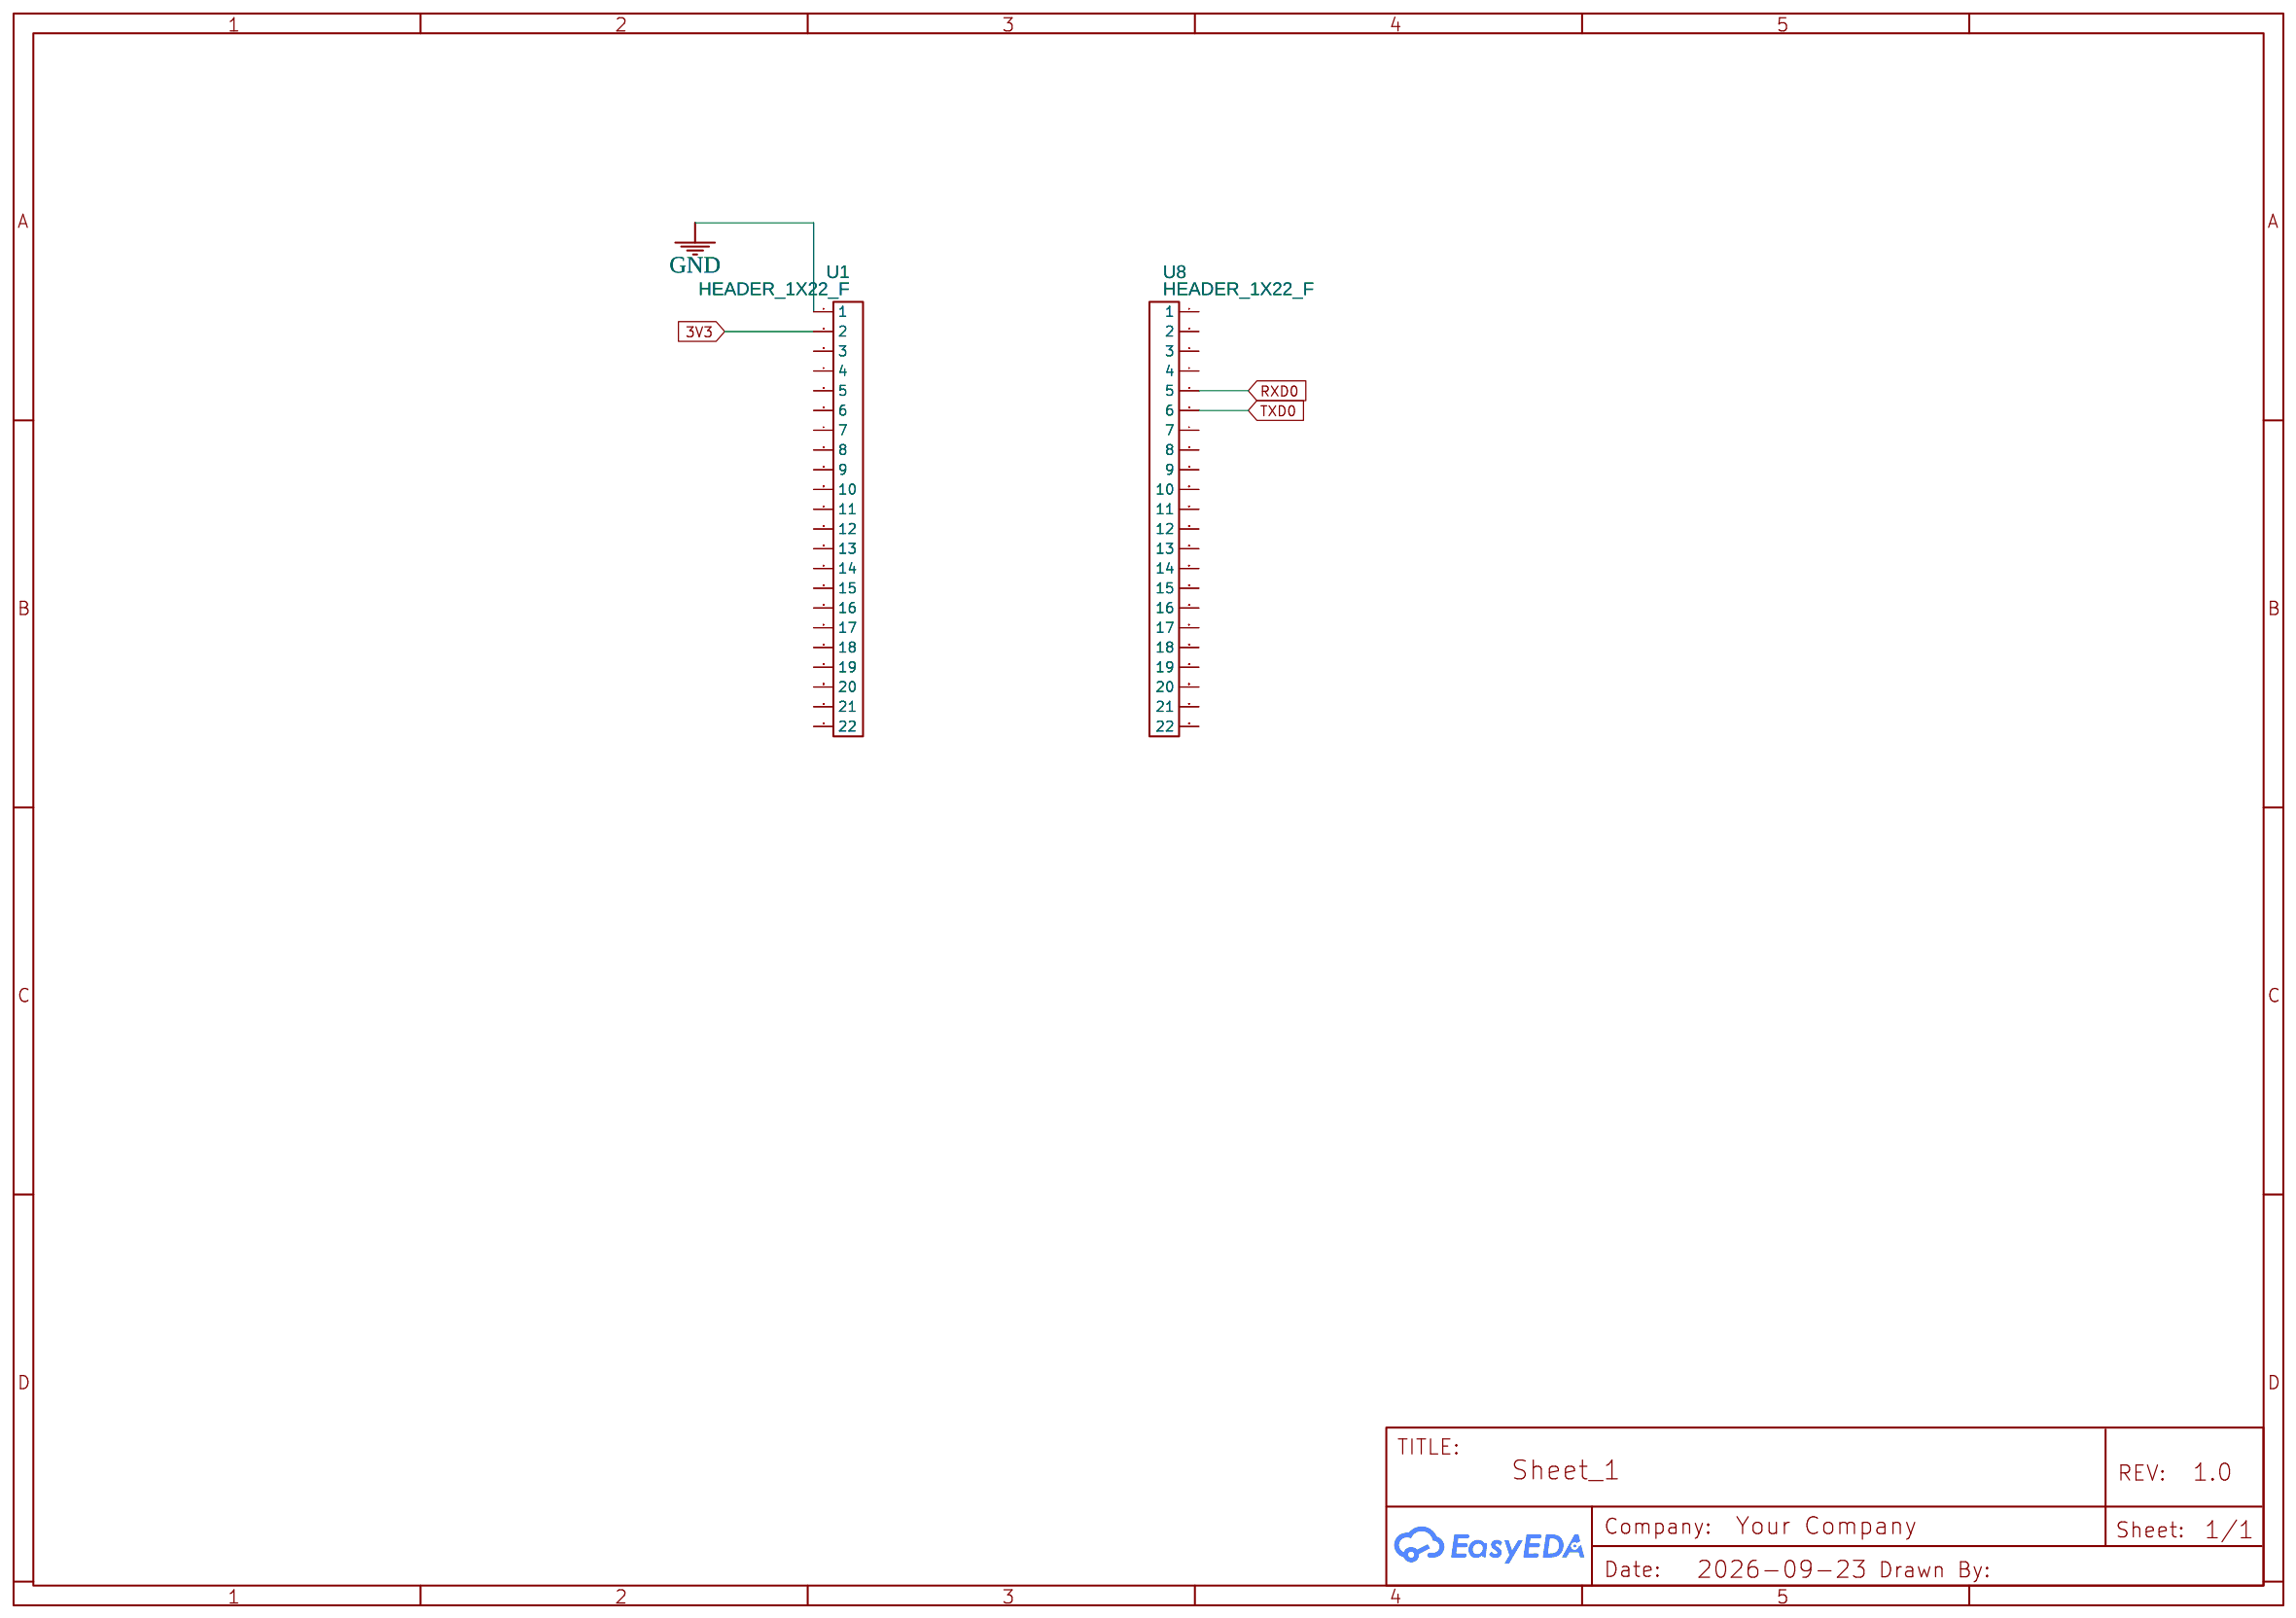
[diagram p8: ESP32-S3-CAM copy]
10 LEDS: Date: 2026-09-28; Drawn By: edinsonl
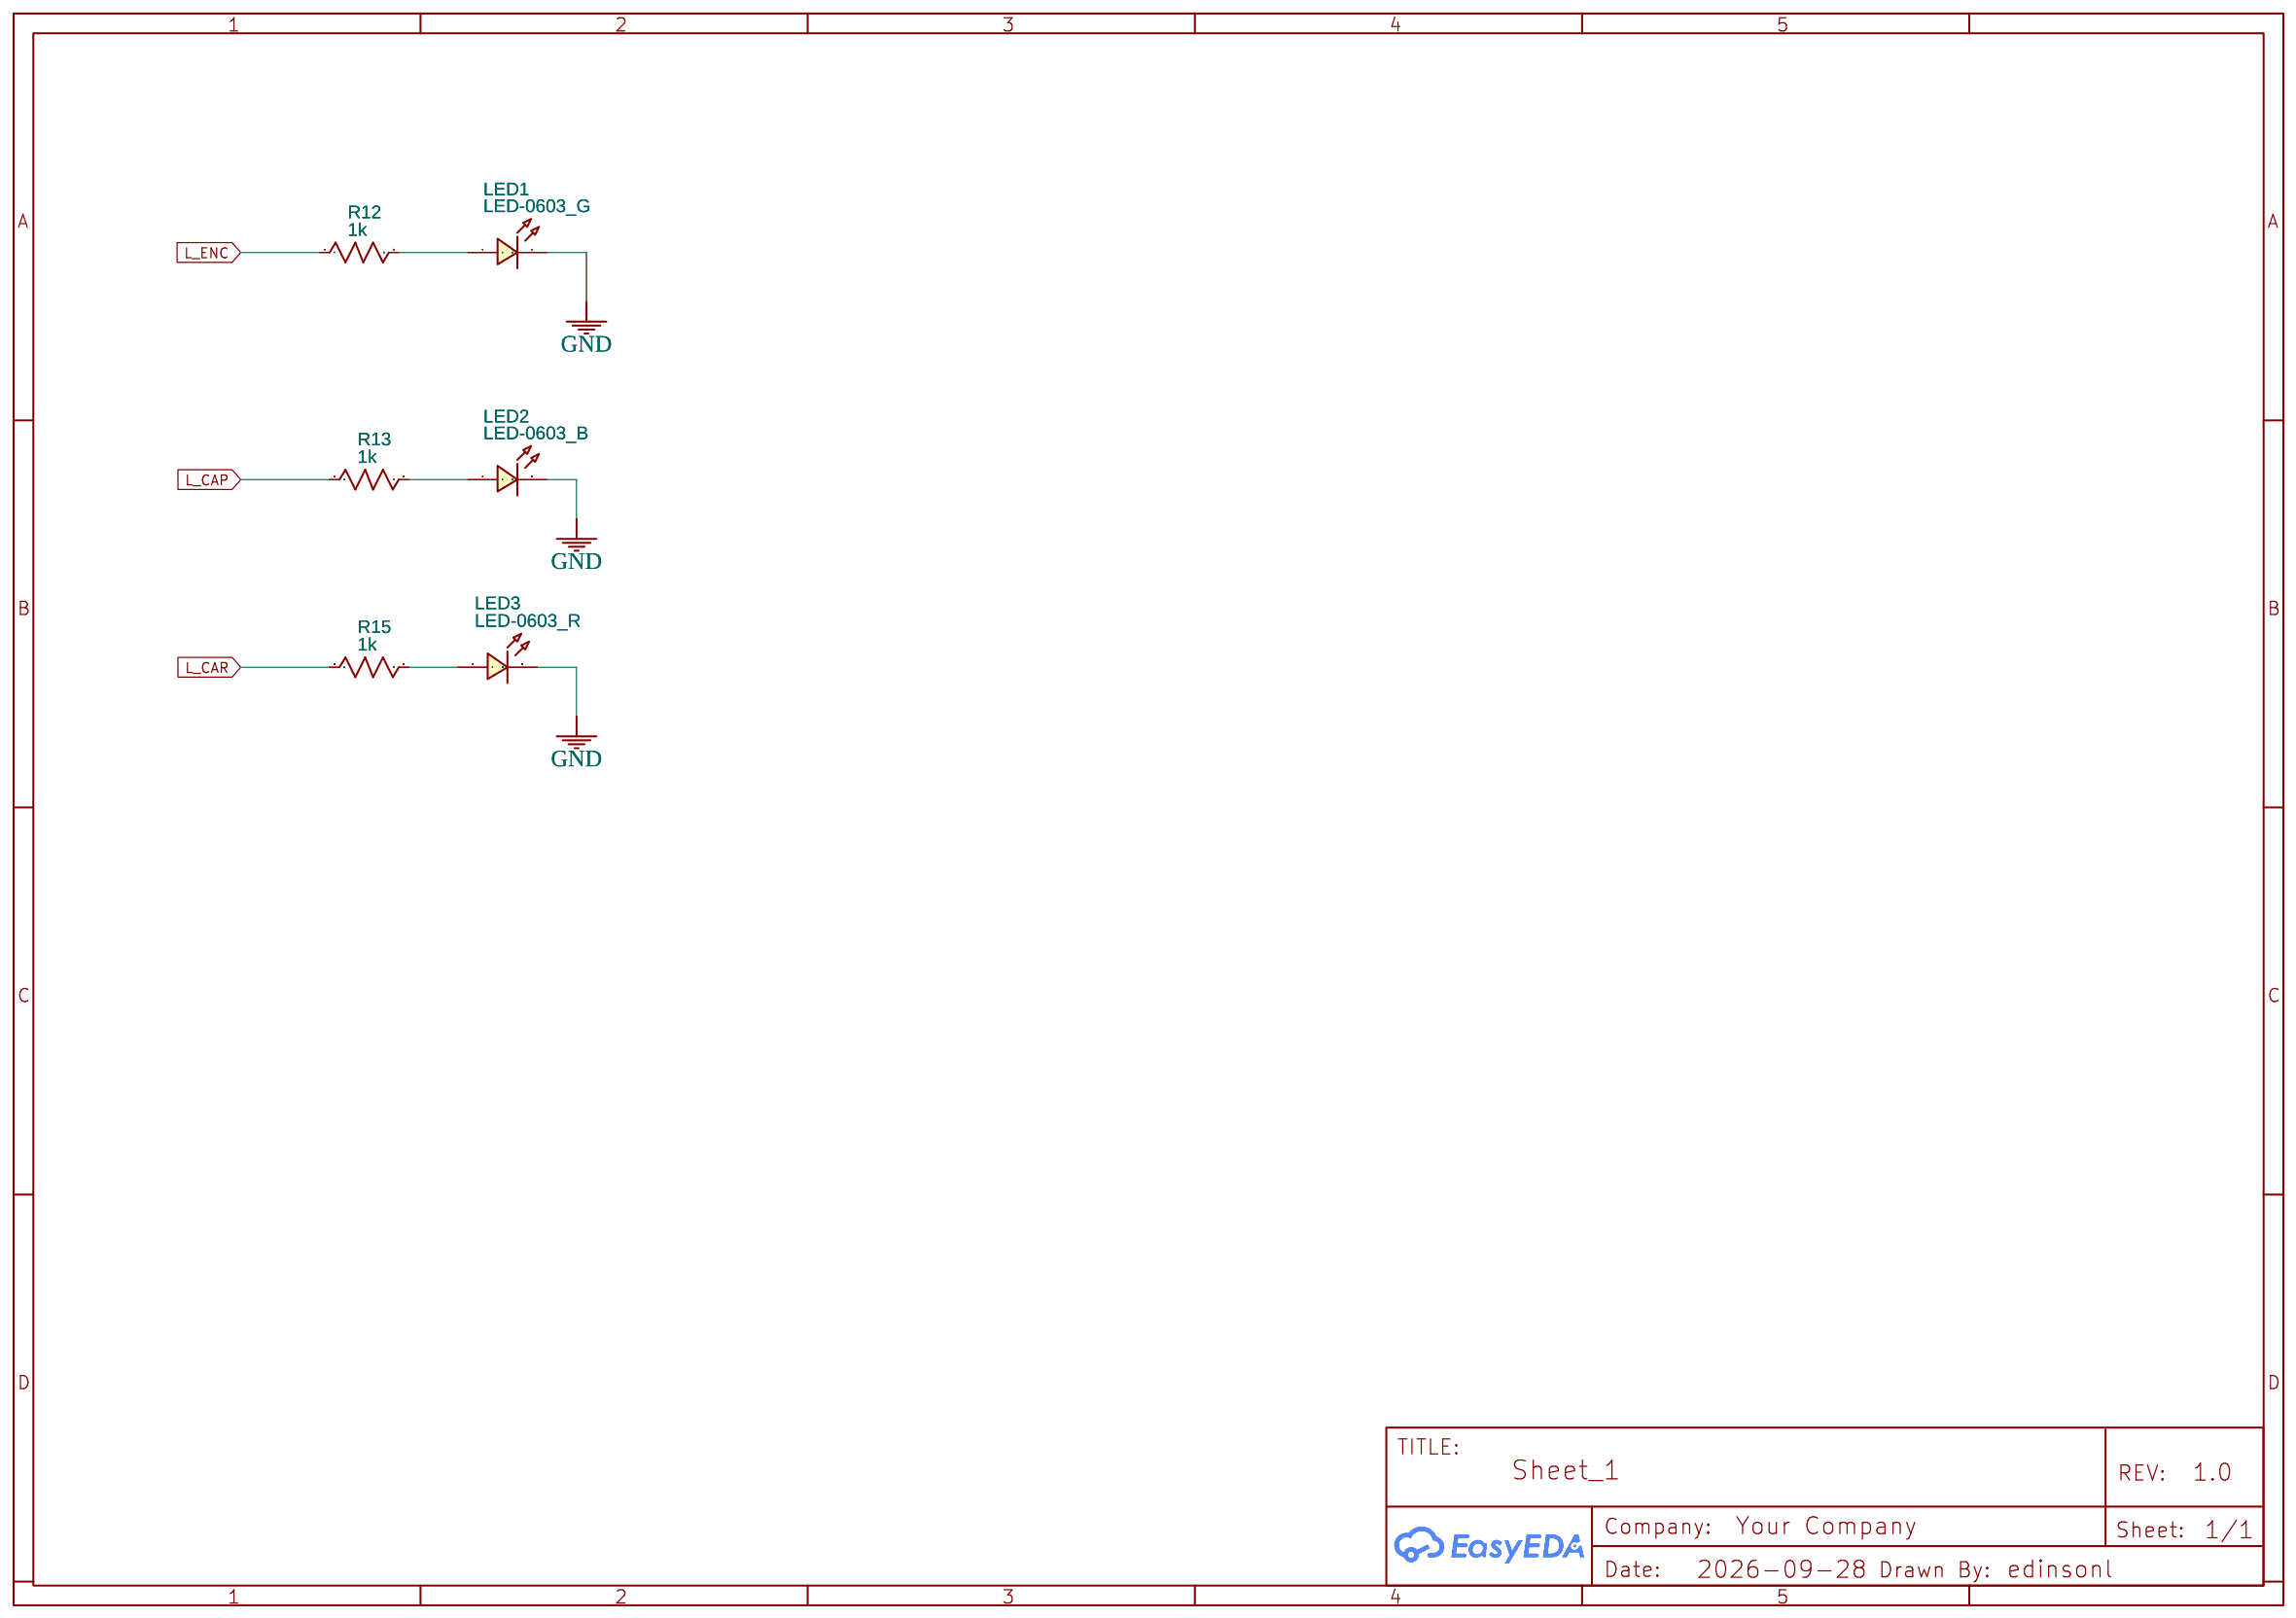
[diagram p9: LEDS]
11 MicroSD: Date: 2026-09-29; Drawn By: edinsonl
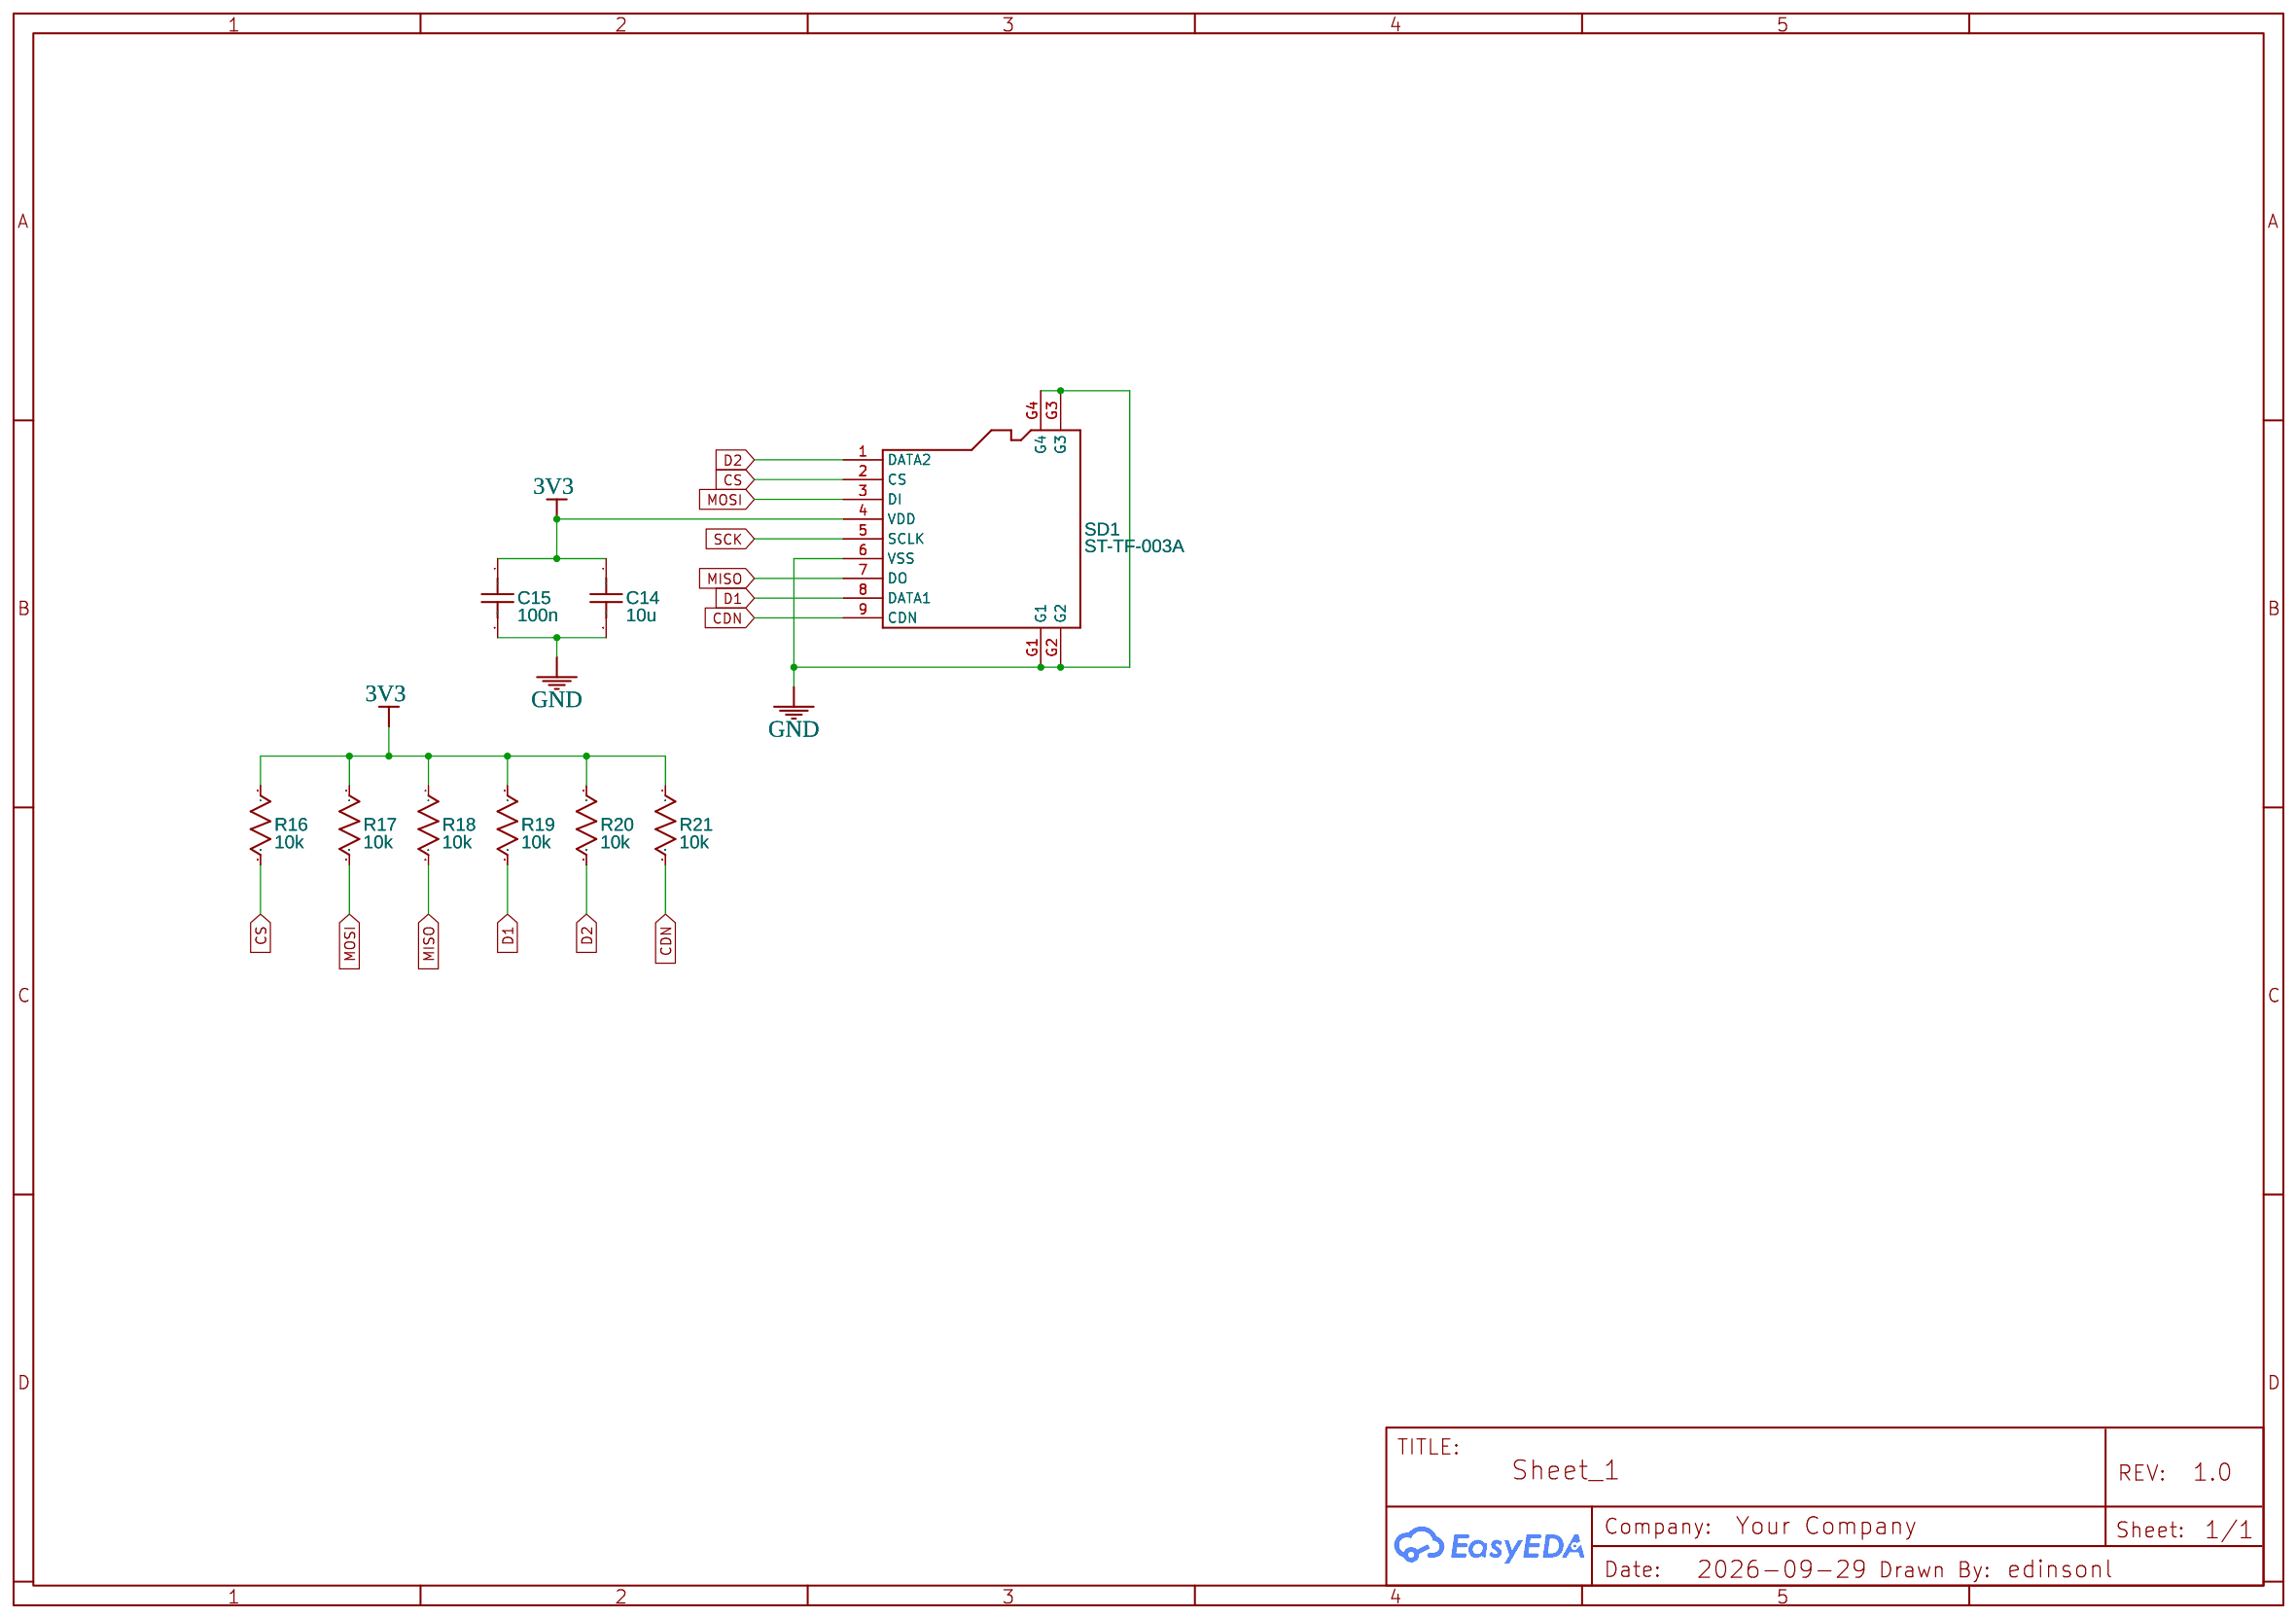
[diagram p10: MicroSD]

## Parts
sheet 12V a 3V3
C4  100u(25V)  [C0603]
C5  100n  [C0603]
C6  10u(50V)  [C0603]
C7  22u(10V)  [C0603]
D1  SS34-SMA  [SMA_L4.3-W2.6-LS5.2-RD]
F1  SMD1206-075C-16V  [F1206]
L1  4.7u(3A)  [L0603]
Q3  AO3401CI-ES  [SOT-23-3_L2.9-W1.3-P1.90-LS2.4-BR]
R14  10k(10%)  [R0603]
U4  KF301-5.0-2P  [CONN-TH_P5.00_KF301-5.0-2P]
U5  SMBJ15A_C5331102  [SMB_L4.5-W3.6-LS5.3-RD]
U6  AP63203WU-7  [TSOT-26_L2.9-W1.6-P0.95-LS2.8-BL]
sheet Botones
C9  1uf/16v(10%)  [C0603]
C10  1uf/16v(10%)  [C0603]
C12  1uf/16v(10%)  [C0603]
C13  1uf/16v(10%)  [C0603]
C16  1uf/16v(10%)  [C0603]
S1  NTC013-AA1J-A160T  [SW-SMD_E-SWITCH_TL1014AFXXX]
S2  NTC013-AA1J-A160T  [SW-SMD_E-SWITCH_TL1014AFXXX]
S3  SWITCH-SPST-2TV  [SWITCH-SPST-VERTICAL]
S4  NTC013-AA1J-A160T  [SW-SMD_E-SWITCH_TL1014AFXXX]
S5  NTC013-AA1J-A160T  [SW-SMD_E-SWITCH_TL1014AFXXX]
S6  NTC013-AA1J-A160T  [SW-SMD_E-SWITCH_TL1014AFXXX]
sheet EPAPER
CN1  B8B-XH-A  [CONN-TH_B8B-XH-A-LF-SN]
sheet ESP32-S3-CAM copy
U1  HEADER_1X22_F  [HEADER1X22FEMALE]
U8  HEADER_1X22_F  [HEADER1X22FEMALE]
sheet ESP32-S3
C1  10uf/25v(20%)  [C0603]
C2  0.1uf/50v(10%)  [C0603]
C3  1uf/16v(10%)  [C0603]
R1  0(1%)  [R0603]
R2  10k(1%)  [R0603]
U7  ESP32-S3-WROOM-1(N16R8)  [WIRELM-SMD_ESP32-S3-WROOM-1]
sheet GPS
H1  HEADER - 2.54_1X4  [HEADER-HEADER-FEMALE-2.54_1X4]
sheet LEDS
LED1  LED-0603_G  [LED0603_GREEN]
LED2  LED-0603_B  [LED0603_BLUE]
LED3  LED-0603_R  [LED0603_RED]
R12  1k  [R0603]
R13  1k  [R0603]
R15  1k  [R0603]
sheet MicroSD
C14  10u  [C0603]
C15  100n  [C0603]
R16  10k  [R0603]
R17  10k  [R0603]
R18  10k  [R0603]
R19  10k  [R0603]
R20  10k  [R0603]
R21  10k  [R0603]
SD1  ST-TF-003A  [MICRO-SD9+4P-SMD-16.1X14.5X1.85MM]
sheet Programacion
Q1  BC818-40LT1G  [SOT-23-3_L2.9-W1.3-P1.83-LS2.4-BR]
Q2  BC818-40LT1G  [SOT-23-3_L2.9-W1.3-P1.83-LS2.4-BR]
R3  10k(1%)  [R0603]
R4  10k(1%)  [R0603]
R5  0(1%)  [R0603]
R6  0(1%)  [R0603]
R7  5.1k(10%)  [R0603]
R8  5.1k(10%)  [R0603]
U2  CH340C  [SOP-16_L10.0-W3.9-P1.27-LS6.0-BL]
USB1  TYPE-C-16PBS-1MD  [TYPE-C-SMD_TYPE-C-16PBS-1MD]
sheet Reloj
C8  0.1u  [C0603]
R9  10k(1%)  [R0603]
R10  10k(1%)  [R0603]
R11  1k(1%)  [R0603]
U9  CR1220-A  [BAT-SMD_CR1220-2]
U10  DS3231N  [SO-16_L10.3-W7.5-P1.27-LS10.3-BL]
sheet sensor NPK, PH, HUMEDAD
PS1  M12-S4A-GPLM12-JD  [CONN-TH_M12-S4A-GPLM12-JD]
U3  RS485  [SOP-8_L4.9-W3.9-P1.27-LS6.0-BL]

## Library data of the parts
C4-C8 C14 C15 = C_0603_US: Contributor: LCEDA_Lib
D1 = SS34-SMA: Contributor: LCSC; Supplier: LCSC; Supplier Part: C9900004127; Manufacturer: null; JLCPCB Part Class: Extended Part
F1 = SMD1206-075C-16V: Supplier: LCSC; Supplier Part: C2760269; Manufacturer: BNstar(比诺星); JLCPCB Part Class: Extended Part; Contributor: lcsc
L1 = L0603_US: Contributor: LCEDA_Lib
Q3 = AO3401CI-ES: Supplier: LCSC; Supplier Part: C21713833; Manufacturer: ElecSuper(静芯); JLCPCB Part Class: Extended Part; Contributor: lcsc
R7-R21 = R_0603_US: Contributor: LCEDA_Lib
U4 = KF301-5.0-2P: Contributor: LCSC; Supplier: LCSC; Supplier Part: C474881; Manufacturer: KEFA(科发); JLCPCB Part Class: Extended Part
U5 = SMBJ15A_C5331102: Supplier: LCSC; Supplier Part: C5331102; Manufacturer: MSKSEMI(美森科); Manufacturer Part: SMBJ15A; JLCPCB Part Class: Extended Part; Contributor: lcsc
U6 = AP63203WU-7: Contributor: LCSC; Supplier: LCSC; Supplier Part: C780769; Manufacturer: DIODES(美台); JLCPCB Part Class: Extended Part
C1-C3 C9 C10 C12 C13 C16 = C_0603_US: Contributor: LCEDA_Lib; Package Display: Yes
S1 S2 S4-S6 = NTC013-AA1J-A160T: Contributor: elettronica_claudio; Package Display: Yes
S3 = SWITCH-SPST-2TV: Contributor: SparkFun
CN1 = B8B-XH-A: Supplier: LCSC; Supplier Part: C20088597; Manufacturer: JST; JLCPCB Part Class: Extended Part; Contributor: lcsc
U1 U8 = HEADER_1X22_F: Contributor: ekoj.a.pesik
R1-R6 = R_0603_US: Contributor: LCEDA_Lib; Package Display: Yes
U7 = ESP32-S3-WROOM-1(N16R8): Contributor: lcsc; Supplier: LCSC; Supplier Part: C2913202; Manufacturer: ESPRESSIF(乐鑫); Manufacturer Part: ESP32-S3-WROOM-1-N16R8; JLCPCB Part Class: Extended Part
H1 = HEADER - 2.54_1X4: Supplier: Private; Contributor: Jo B
LED1 LED2 = LED-0603_R: Manufacturer: EVERLIGHT(台湾亿光); Manufacturer Part: 19-217/R6C-AL1M2VY/3T; Supplier Part: C72044; Supplier: LCSC; Contributor: LCEDA_01; Package Display: No
LED3 = LED-0603_R: Manufacturer: EVERLIGHT(台湾亿光); Manufacturer Part: 19-217/R6C-AL1M2VY/3T; Supplier Part: C72044; Supplier: LCSC; Contributor: LCEDA_01
SD1 = ST-TF-003A: Micro SD Card Socket
Q1 Q2 = BC818-40LT1G: Contributor: LCSC; Supplier: LCSC; Manufacturer: onsemi(安森美); Supplier Part: C154797; JLCPCB Part Class: Extended Part; Package Display: Yes
U2 = CH340C: Supplier: LCSC; Manufacturer: WCH(南京沁恒); Supplier Part: C84681; JLCPCB Part Class: Extended Part
USB1 = TYPE-C-16PBS-1MD: Supplier: LCSC; Supplier Part: C51927421; Manufacturer: CAX(创都); JLCPCB Part Class: Extended Part; Contributor: lcsc
U9 = CR1220-A: Contributor: lcsc; Supplier: LCSC; Supplier Part: C9900016718; Manufacturer: null; JLCPCB Part Class: Extended Part
U10 = DS3231N: Contributor: LCSC; Supplier: LCSC; Supplier Part: C9900010264; Manufacturer: null; JLCPCB Part Class: Extended Part
PS1 = M12-S4A-GPLM12-JD: Supplier: LCSC; Supplier Part: C42931309; Manufacturer: CAZN(正成); Contributor: lcsc; JLCPCB Part Class: Extended Part
U3 = RS485: Supplier: LCSC; Supplier Part: C19631832; Manufacturer: GR(国睿); JLCPCB Part Class: Extended Part; Contributor: lcsc

## Nets
3V3: C1.1 C2.2 C7.1 C8.1 C14.1 C15.1 CN1.1 H1.4 L1.2 R1.1 R2.2 R9.1 R10.1 R11.1 R16.1 R17.1 R18.1 R19.1 R20.1 R21.1 SD1.4(VDD) U1.2 U2.4(V3) U2.16(VCC) U3.8(VCC) U6.1(FB) U10.2(VCC)
12V: C4.1 C6.1 D1.2 PS1.1 Q3.2(S) Q3.3(D) R14.1 S3.1(O) U5.1(C) U6.2(EN) U6.3(VIN)
GND: C1.2 C2.1 C3.1 C4.2 C6.2 C7.2 C8.2 C9.1 C10.1 C12.1 C13.1 C14.2 C15.2 C16.1 CN1.2 H1.1 LED1.2 LED2.2 LED3.2 PS1.3 R7.2 R8.1 S1.1(NO) S2.1(NO) S3.2(P) S4.1(NO) S5.1(NO) S6.1(NO) SD1.6(VSS) SD1.G1 SD1.G2 SD1.G3 SD1.G4 U1.1 U2.1(GND) U3.5(VO1) U4.2 U5.2(A) U6.4(GND) U7.1(GND) U7.40(GND) U7.41(GND) U9.2 U10.5(N.C.) U10.6(N.C.) U10.7(N.C.) U10.8(N.C.) U10.9(N.C.) U10.10(N.C.) U10.11(N.C.) U10.12(N.C.) U10.13(GND) USB1.1(EH) USB1.2(EH) USB1.3(EH) USB1.4(EH) USB1.A1B12(GND) USB1.B1A12(GND)
VBUS: USB1.A4B9(VBUS) USB1.B4A9(VBUS)
32kHz: U10.1(32KHZ)
Boot: C9.2 R6.2 S2.3(COM_2) U7.27(IO0)
CAP: C12.2 S4.3(COM_2) U7.4(IO4)
CAR: C13.2 S5.3(COM_2) U7.5(IO5)
CDN: R21.2 SD1.9(CDN) U7.22(IO14)
CS: R16.2 SD1.2(CS) U7.18(IO10)
D1: R19.2 SD1.8(DATA1)
D2: R20.2 SD1.1(DATA2)
DTR: Q2.2(E) R3.1 U2.13(DTR#)
EN: C3.2 C10.2 R2.1 R5.2 S1.3(COM_2) U7.3(EN)
EPD_BUSY: CN1.8 U7.31(IO38)
EPD_CS: CN1.5 U7.23(IO21)
EPD_DC: CN1.6 U7.24(IO47)
EPD_RST: CN1.7 U7.25(IO48)
ESP-3V3: R1.2 U7.2(3V3)
IO16: U3.2(RE#) U3.3(DE) U7.9(IO16)
IO17: U3.4(DI) U7.10(IO17)
IO18: U3.1(R0) U7.11(IO18)
L_CAP: R13.1 U7.7(IO7)
L_CAR: R15.1 U7.8(IO15)
L_ENC: R12.1 U7.6(IO6)
MISO: R18.2 SD1.7(DO) U7.21(IO13)
MOSI: CN1.3 R17.2 SD1.3(DI) U7.19(IO11)
RESET_RTC: C16.2 S6.3(COM_2) U10.4(RST#)
RTS: Q1.2(E) R4.1 U2.14(RTS#)
RX_GPS: H1.3 U7.12(IO8)
RXD0: U2.2(TXD) U7.36(RXD0) U8.5
SCK: CN1.4 SD1.5(SCLK) U7.20(IO12)
SCL: R9.2 U7.38(IO2) U10.16(SCL)
SDA: R10.2 U7.39(IO1) U10.15(SDA)
TX_GPS: H1.2 U7.17(IO9)
TXD0: U2.3(RXD) U7.37(TXD0) U8.6
USB_DN: U2.6(D-) USB1.A7(DN1) USB1.B7(DN2)
USB_DP: U2.5(D+) USB1.A6(DP1) USB1.B6(DP2)
Net-(C5-1): C5.1 U6.6(BST)
Net-(C5-2): C5.2 L1.1 U6.5(SW)
Net-(D1-1): D1.1 F1.2
Net-(F1-1): F1.1 U4.1
Net-(LED1-1): LED1.1 R12.2
Net-(LED2-1): LED2.1 R13.2
Net-(LED3-1): LED3.1 R15.2
Net-(PS1-2): PS1.2 U3.6(A)
Net-(PS1-4): PS1.4 U3.7(B)
Net-(Q1-1): Q1.1(B) R3.2
Net-(Q1-3): Q1.3(C) R5.1
Net-(Q2-1): Q2.1(B) R4.2
Net-(Q2-3): Q2.3(C) R6.1
Net-(Q3-1): Q3.1(G) R14.2
Net-(R7-1): R7.1 USB1.A5(CC1)
Net-(R8-2): R8.2 USB1.B5(CC2)
Net-(R11-2): R11.2 U10.3(INT/SQW)
Net-(U9-1): U9.1 U10.14(VBAT)

Not connected (* = marked no-connect by the designer): PS1 5*; S1 2(COM_1)* 4(NO_2)*; S2 2(COM_1)* 4(NO_2)*; S4 2(COM_1)* 4(NO_2)*; S5 2(COM_1)* 4(NO_2)*; S6 2(COM_1)* 4(NO_2)*; U1 3 4 5 6 7 8 9 10 11 12 13 14 15 16 17 18 19 20 21 22; U2 7(NC.) 8(OUT#) 9(CTS#) 10(DSR#) 11(RI#) 12(DCD#) 15(R232); U7 13(IO19) 14(IO20) 15(IO3) 16(IO46) 26(IO45) 28(IO35) 29(IO36) 30(IO37) 32(IO39) 33(IO40) 34(IO41) 35(IO42); U8 1 2 3 4 7 8 9 10 11 12 13 14 15 16 17 18 19 20 21 22; USB1 A8(SUB1) B8(SUB2)
